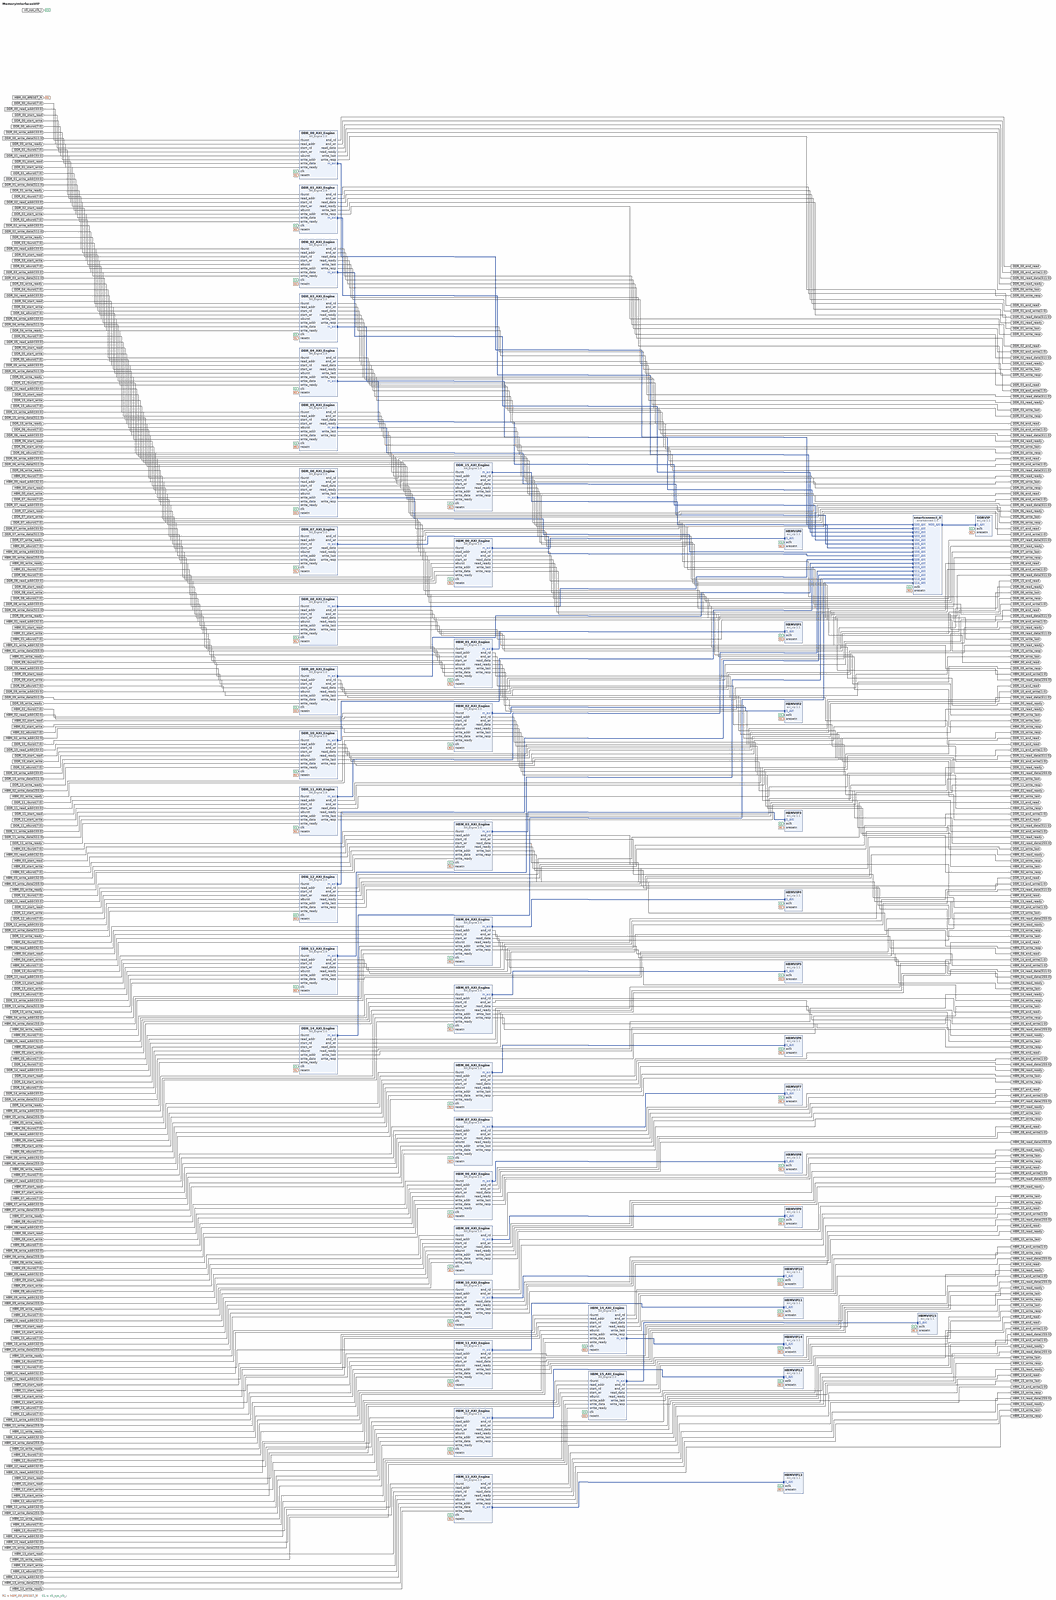
[diagram p0: block diagram of the top level, whole]
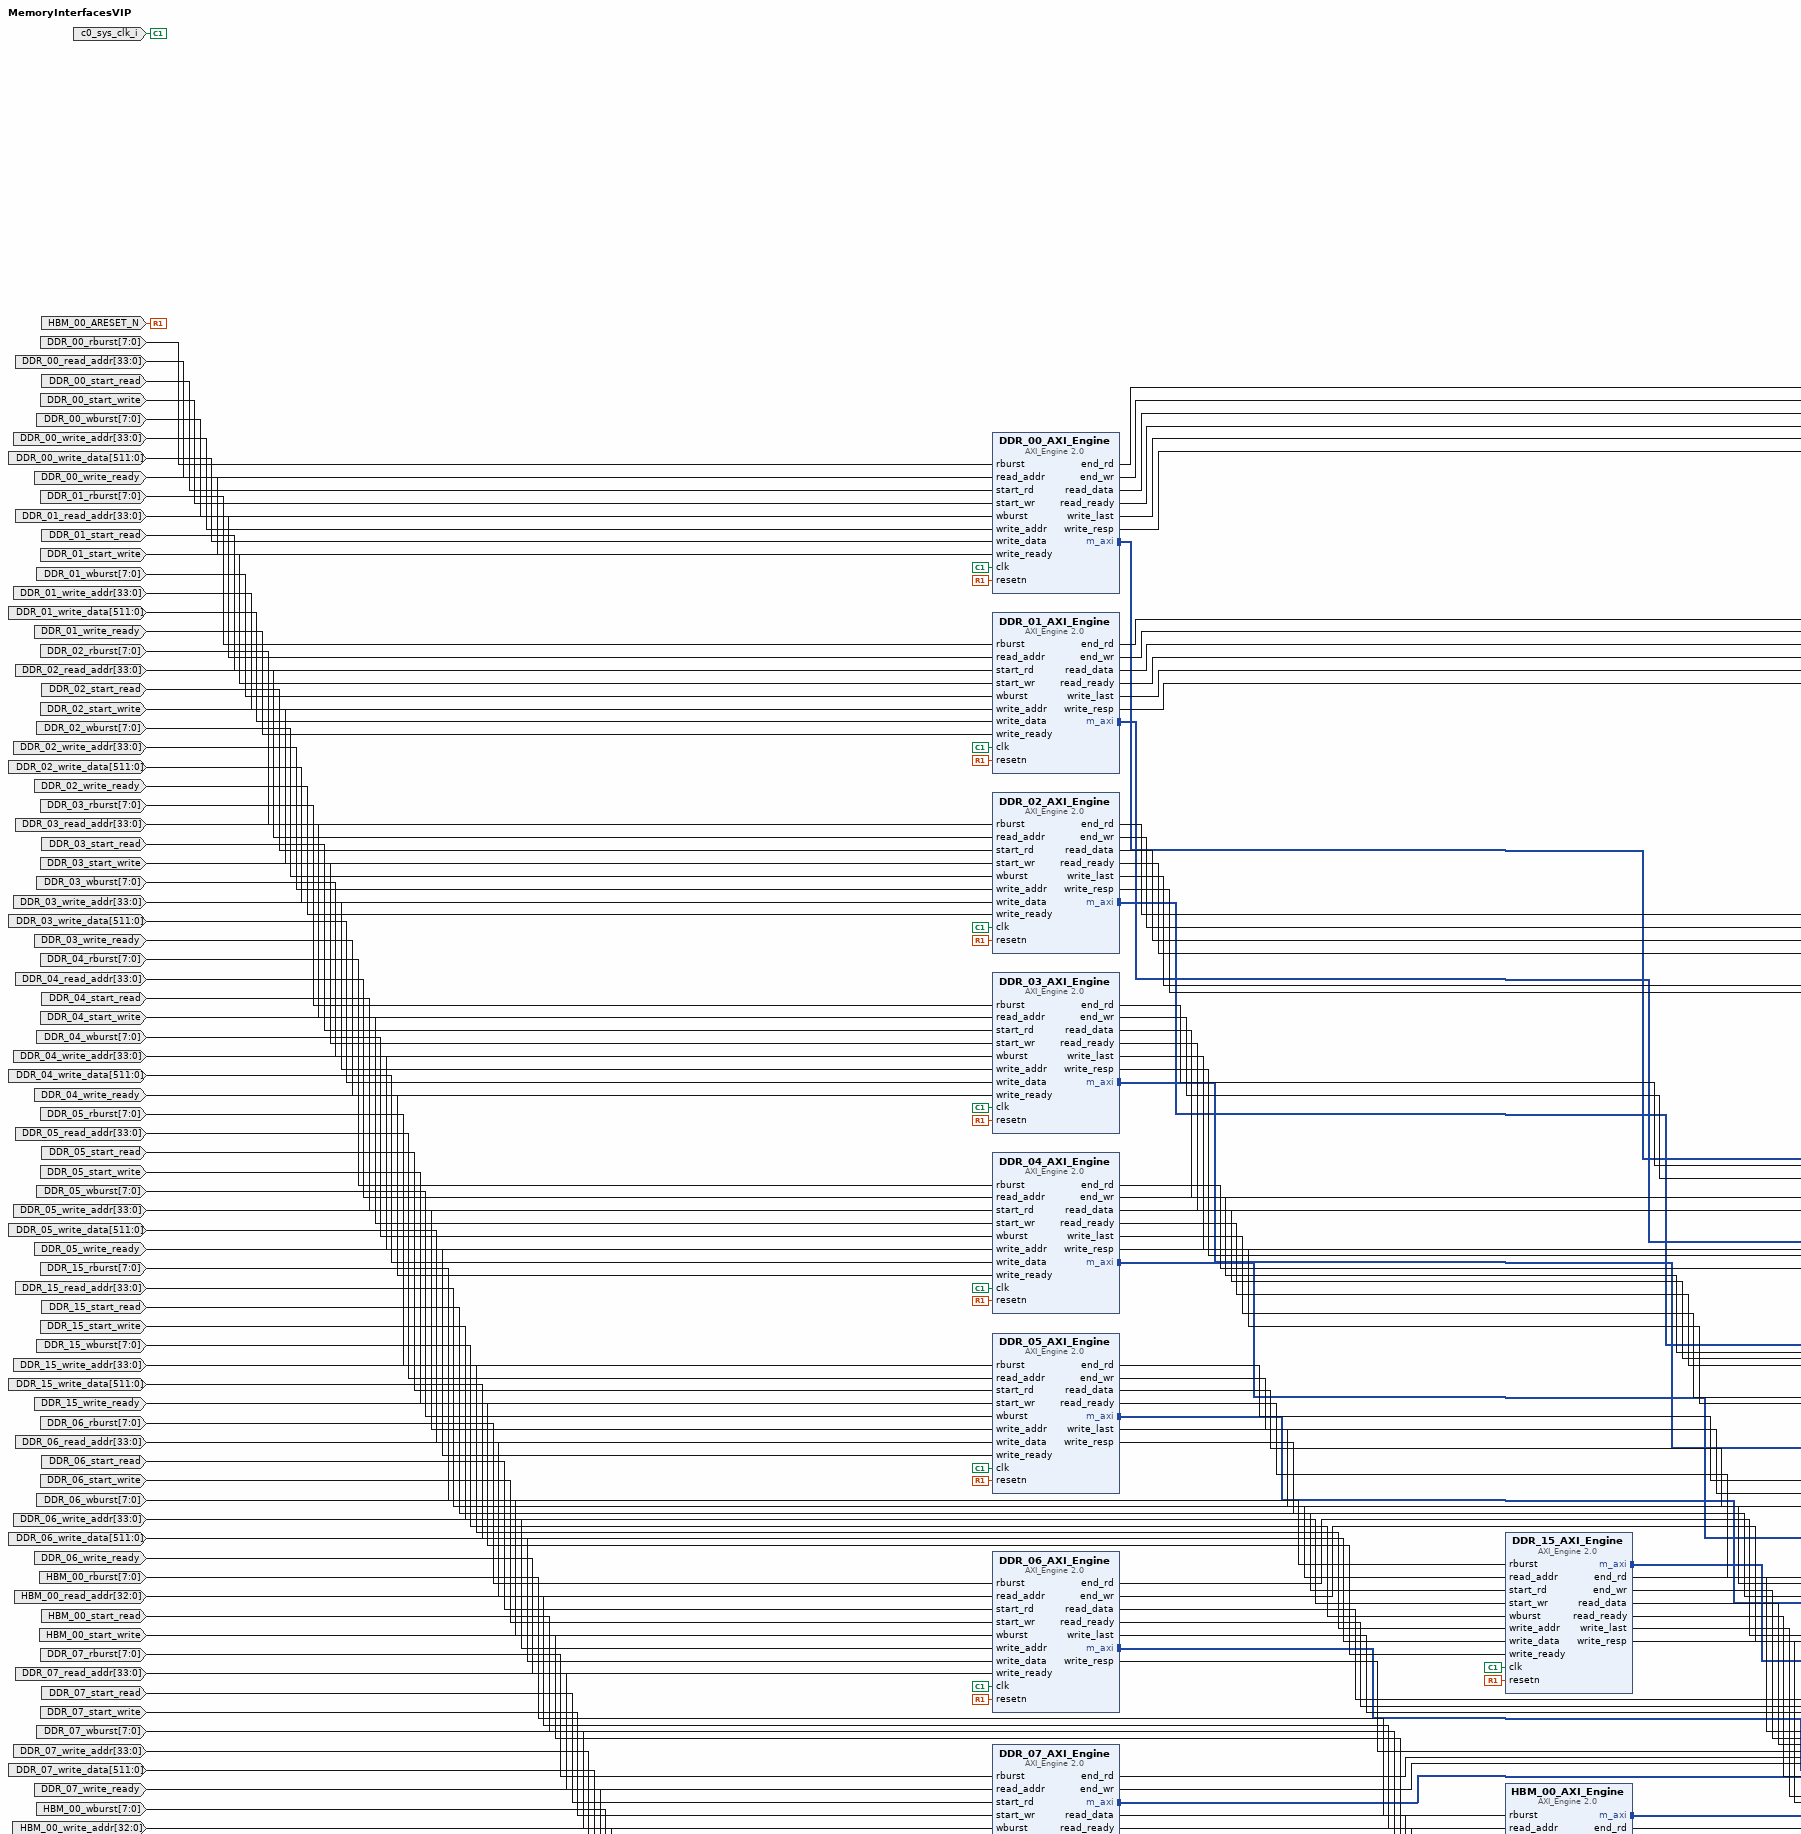
[diagram p1: block diagram of the top level, upper left part]
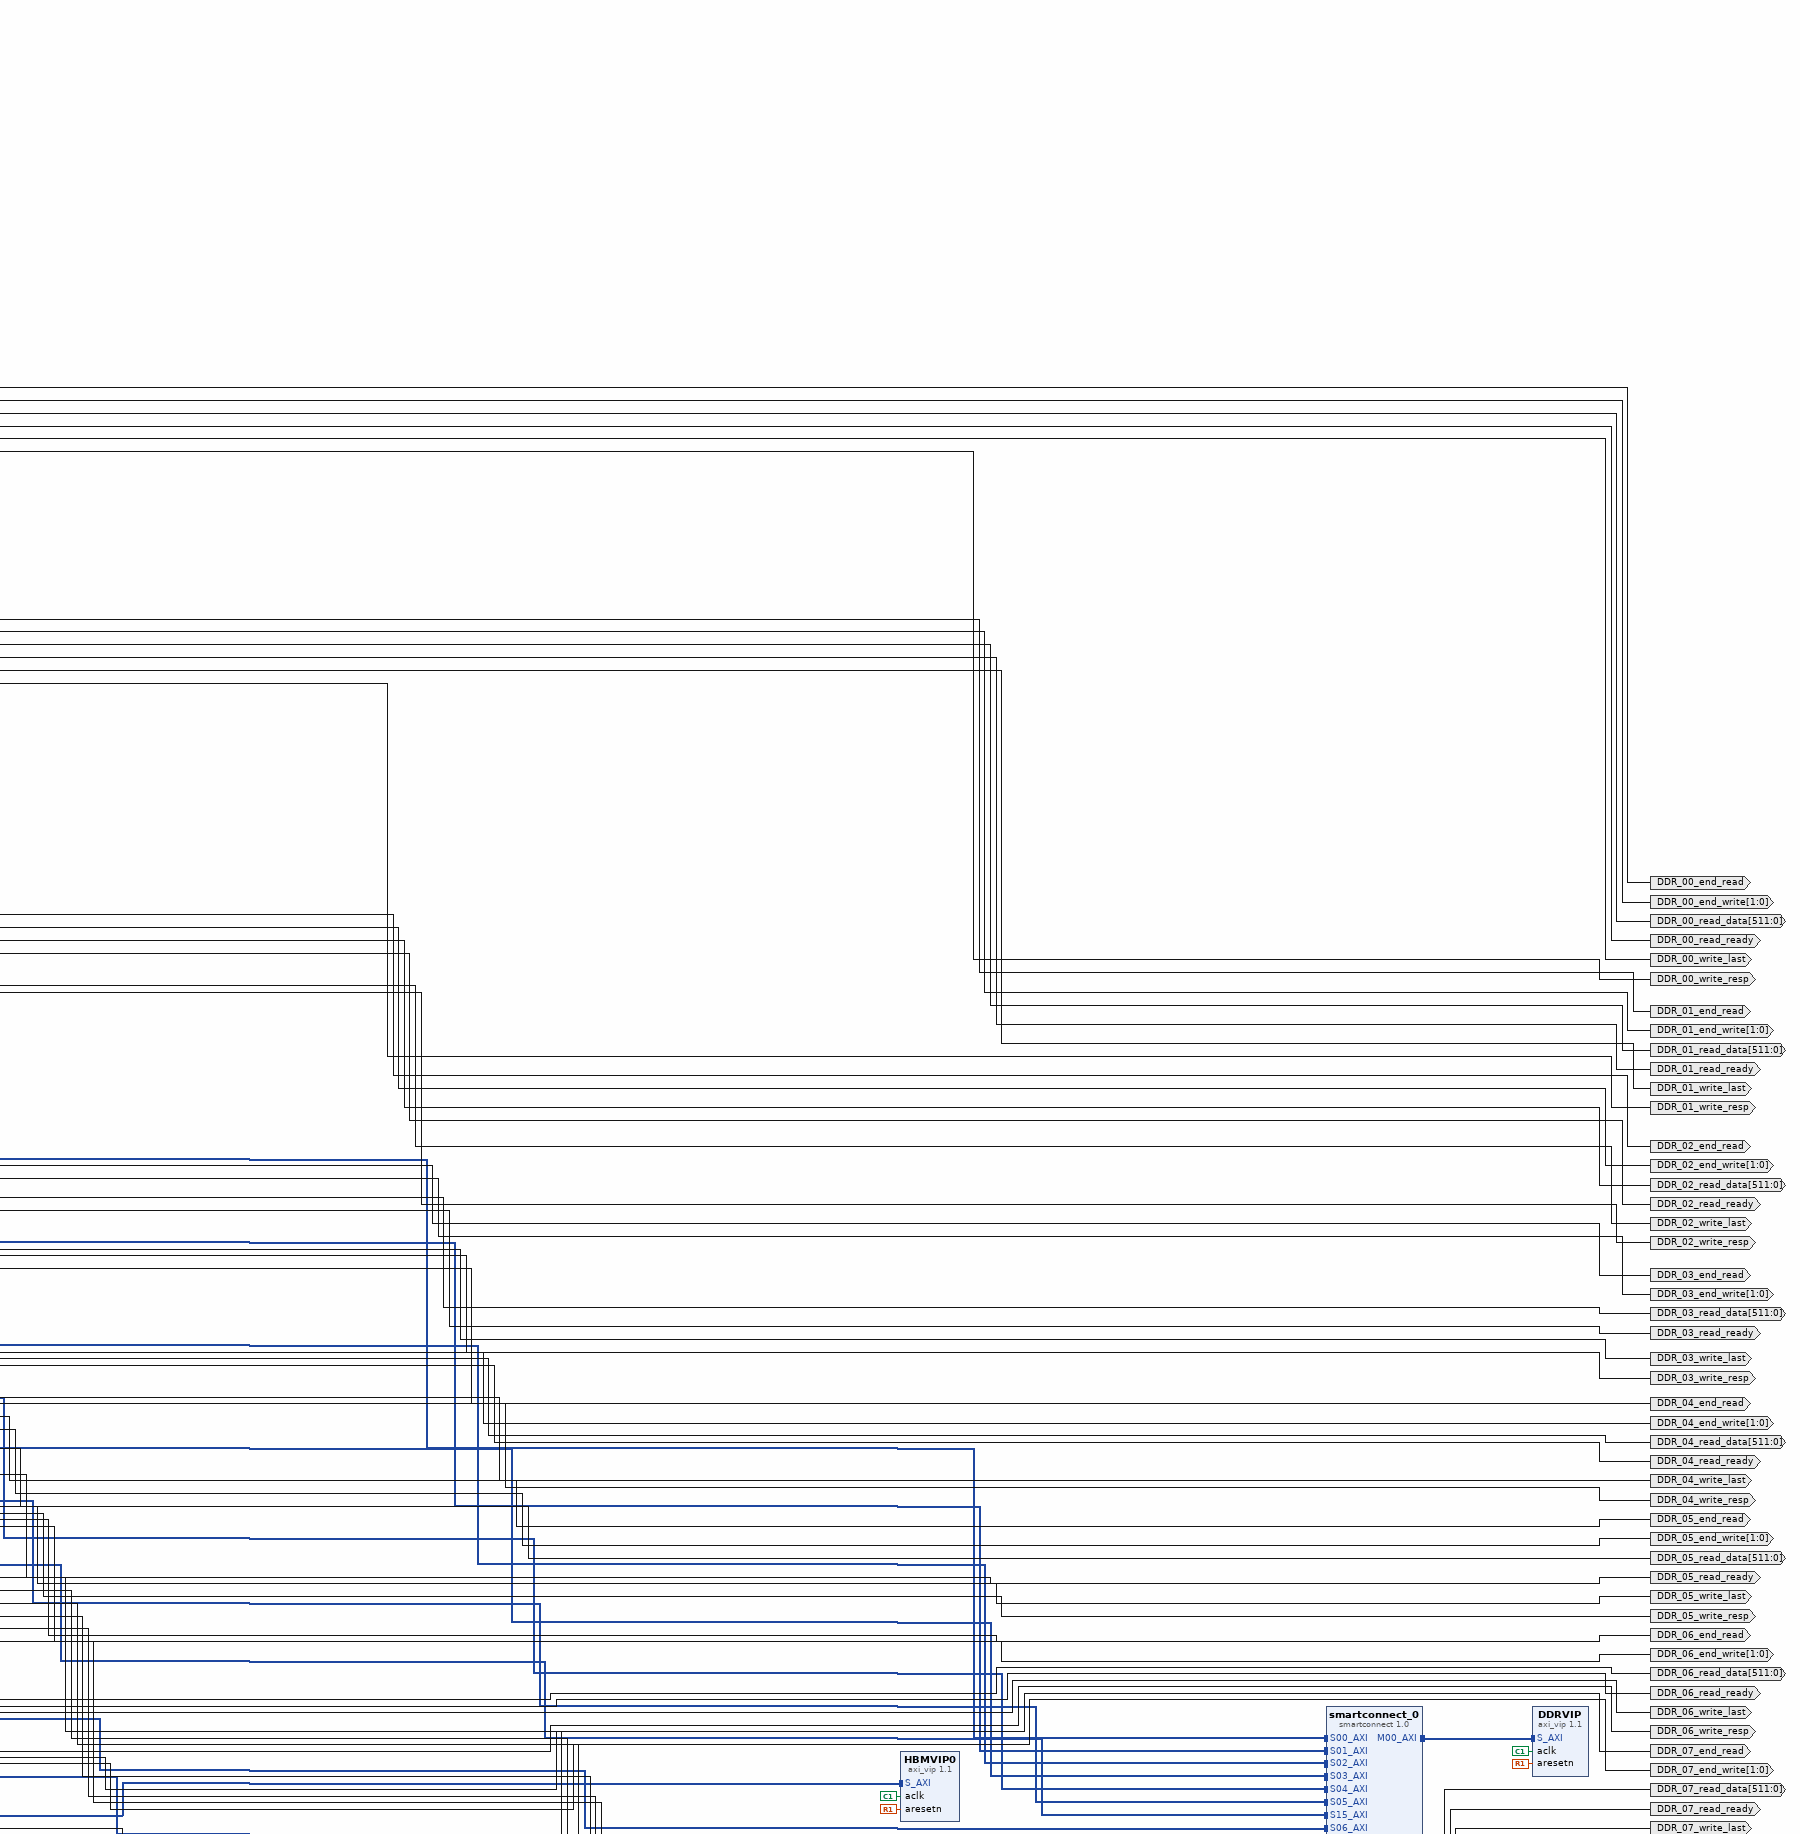
[diagram p2: block diagram of the top level, upper right part]
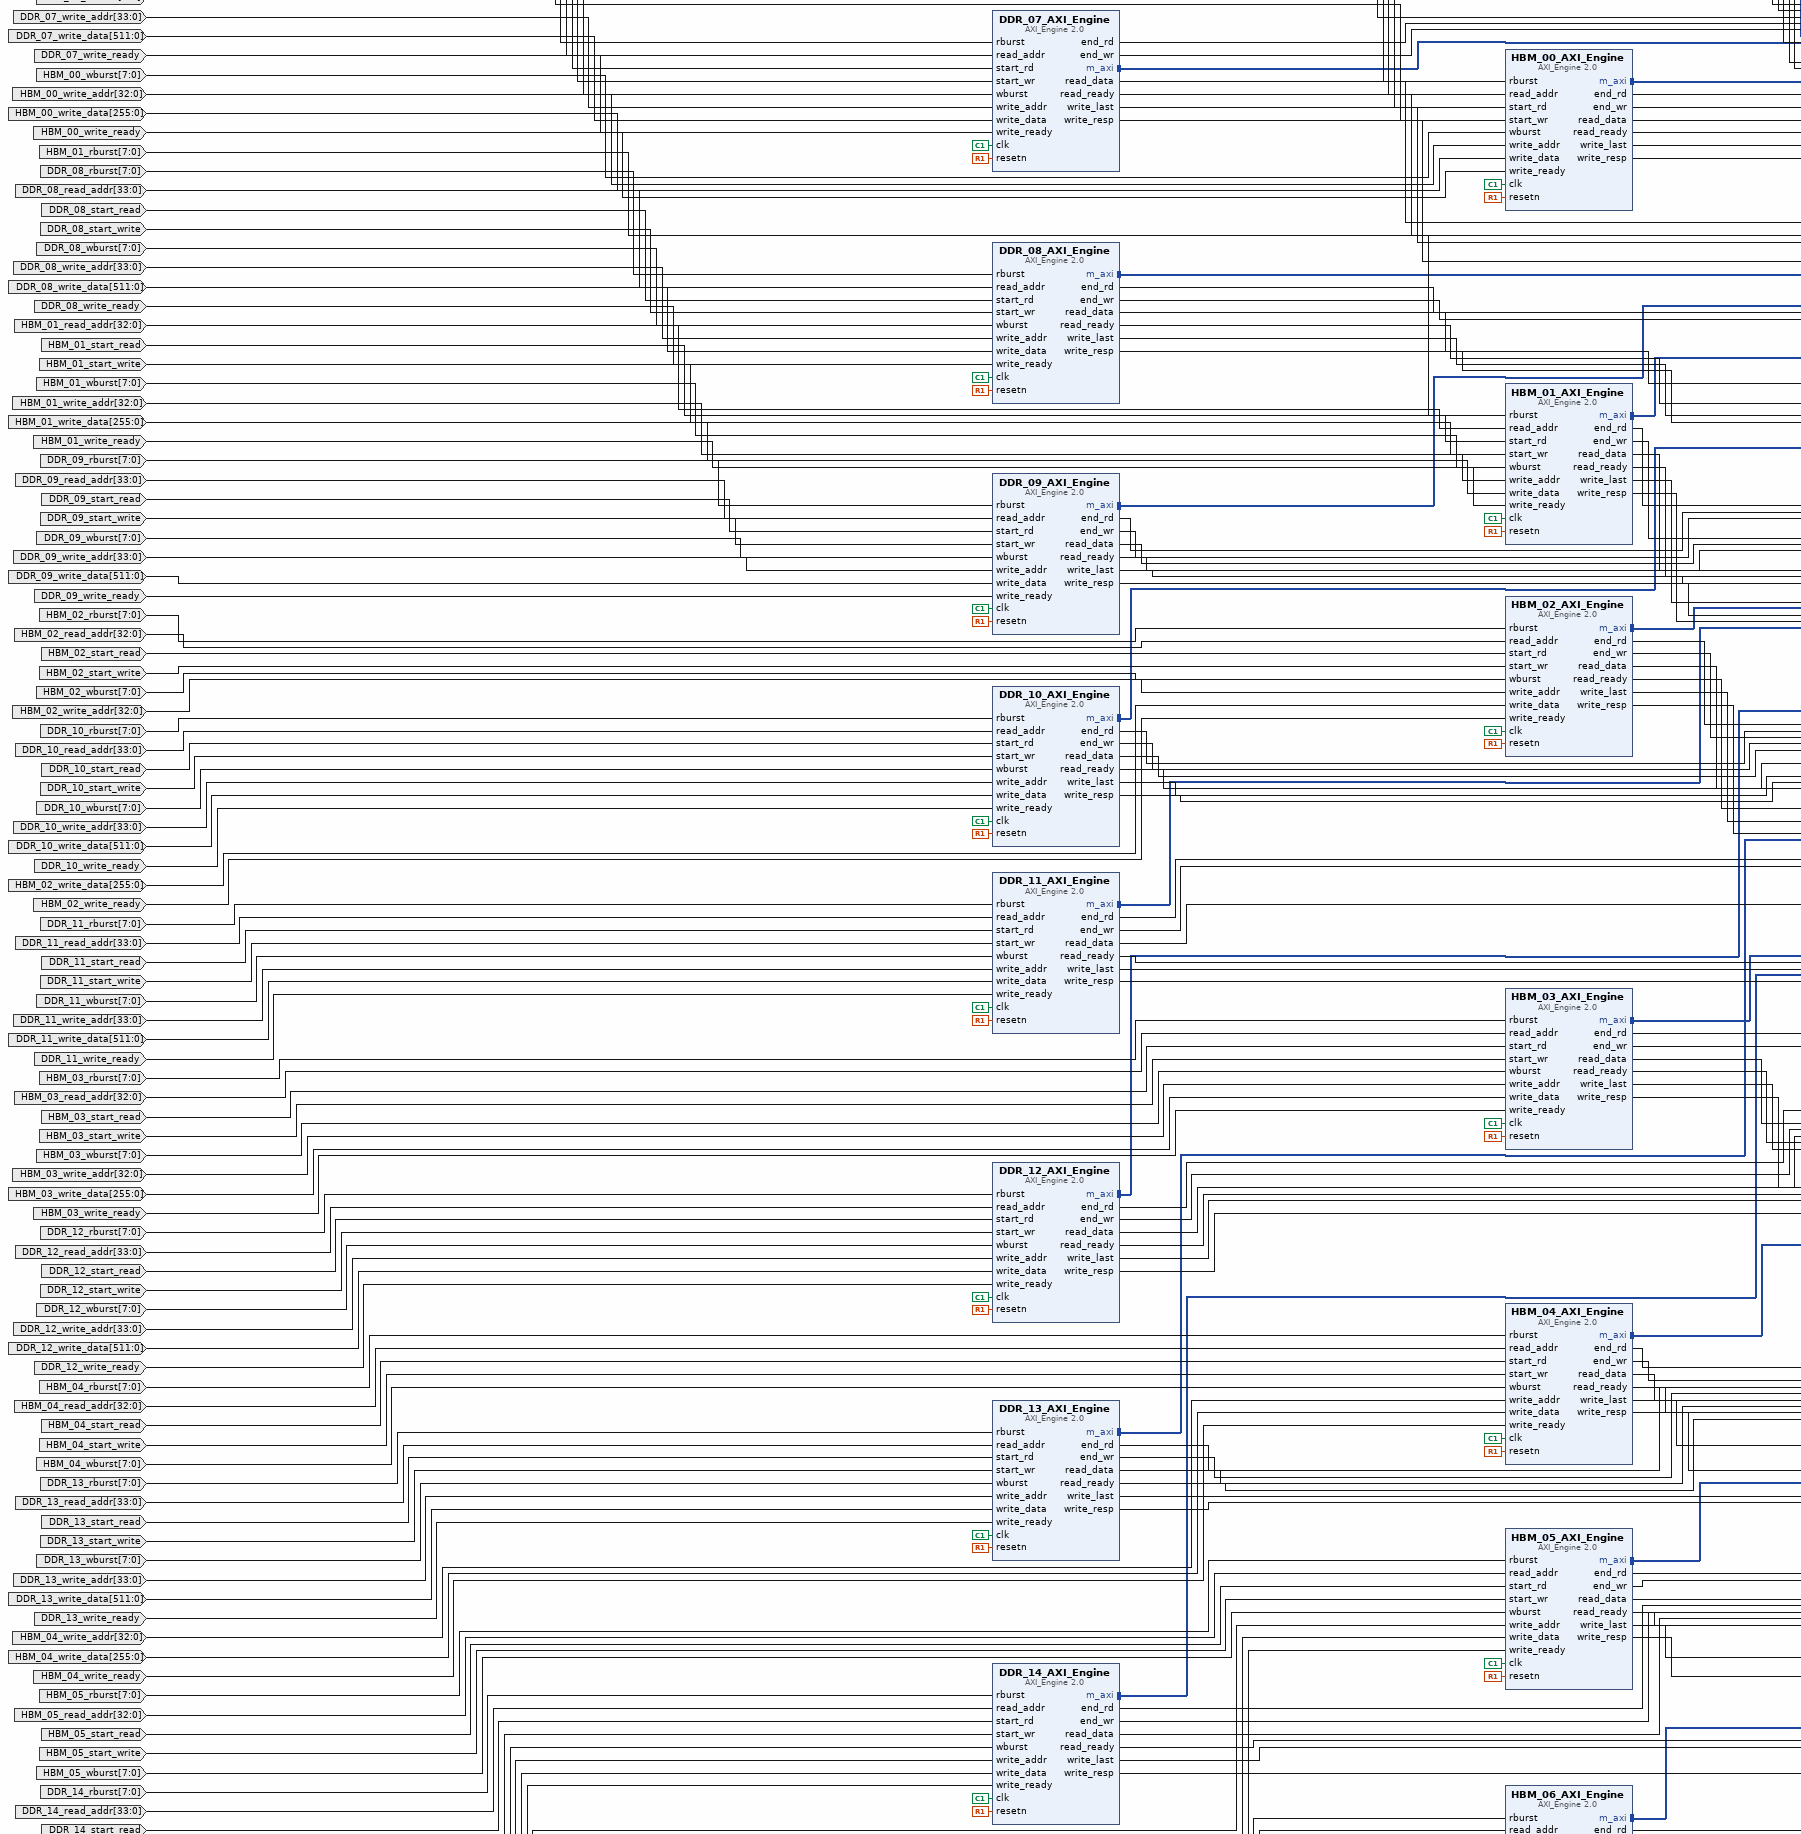
[diagram p3: block diagram of the top level, middle left part]
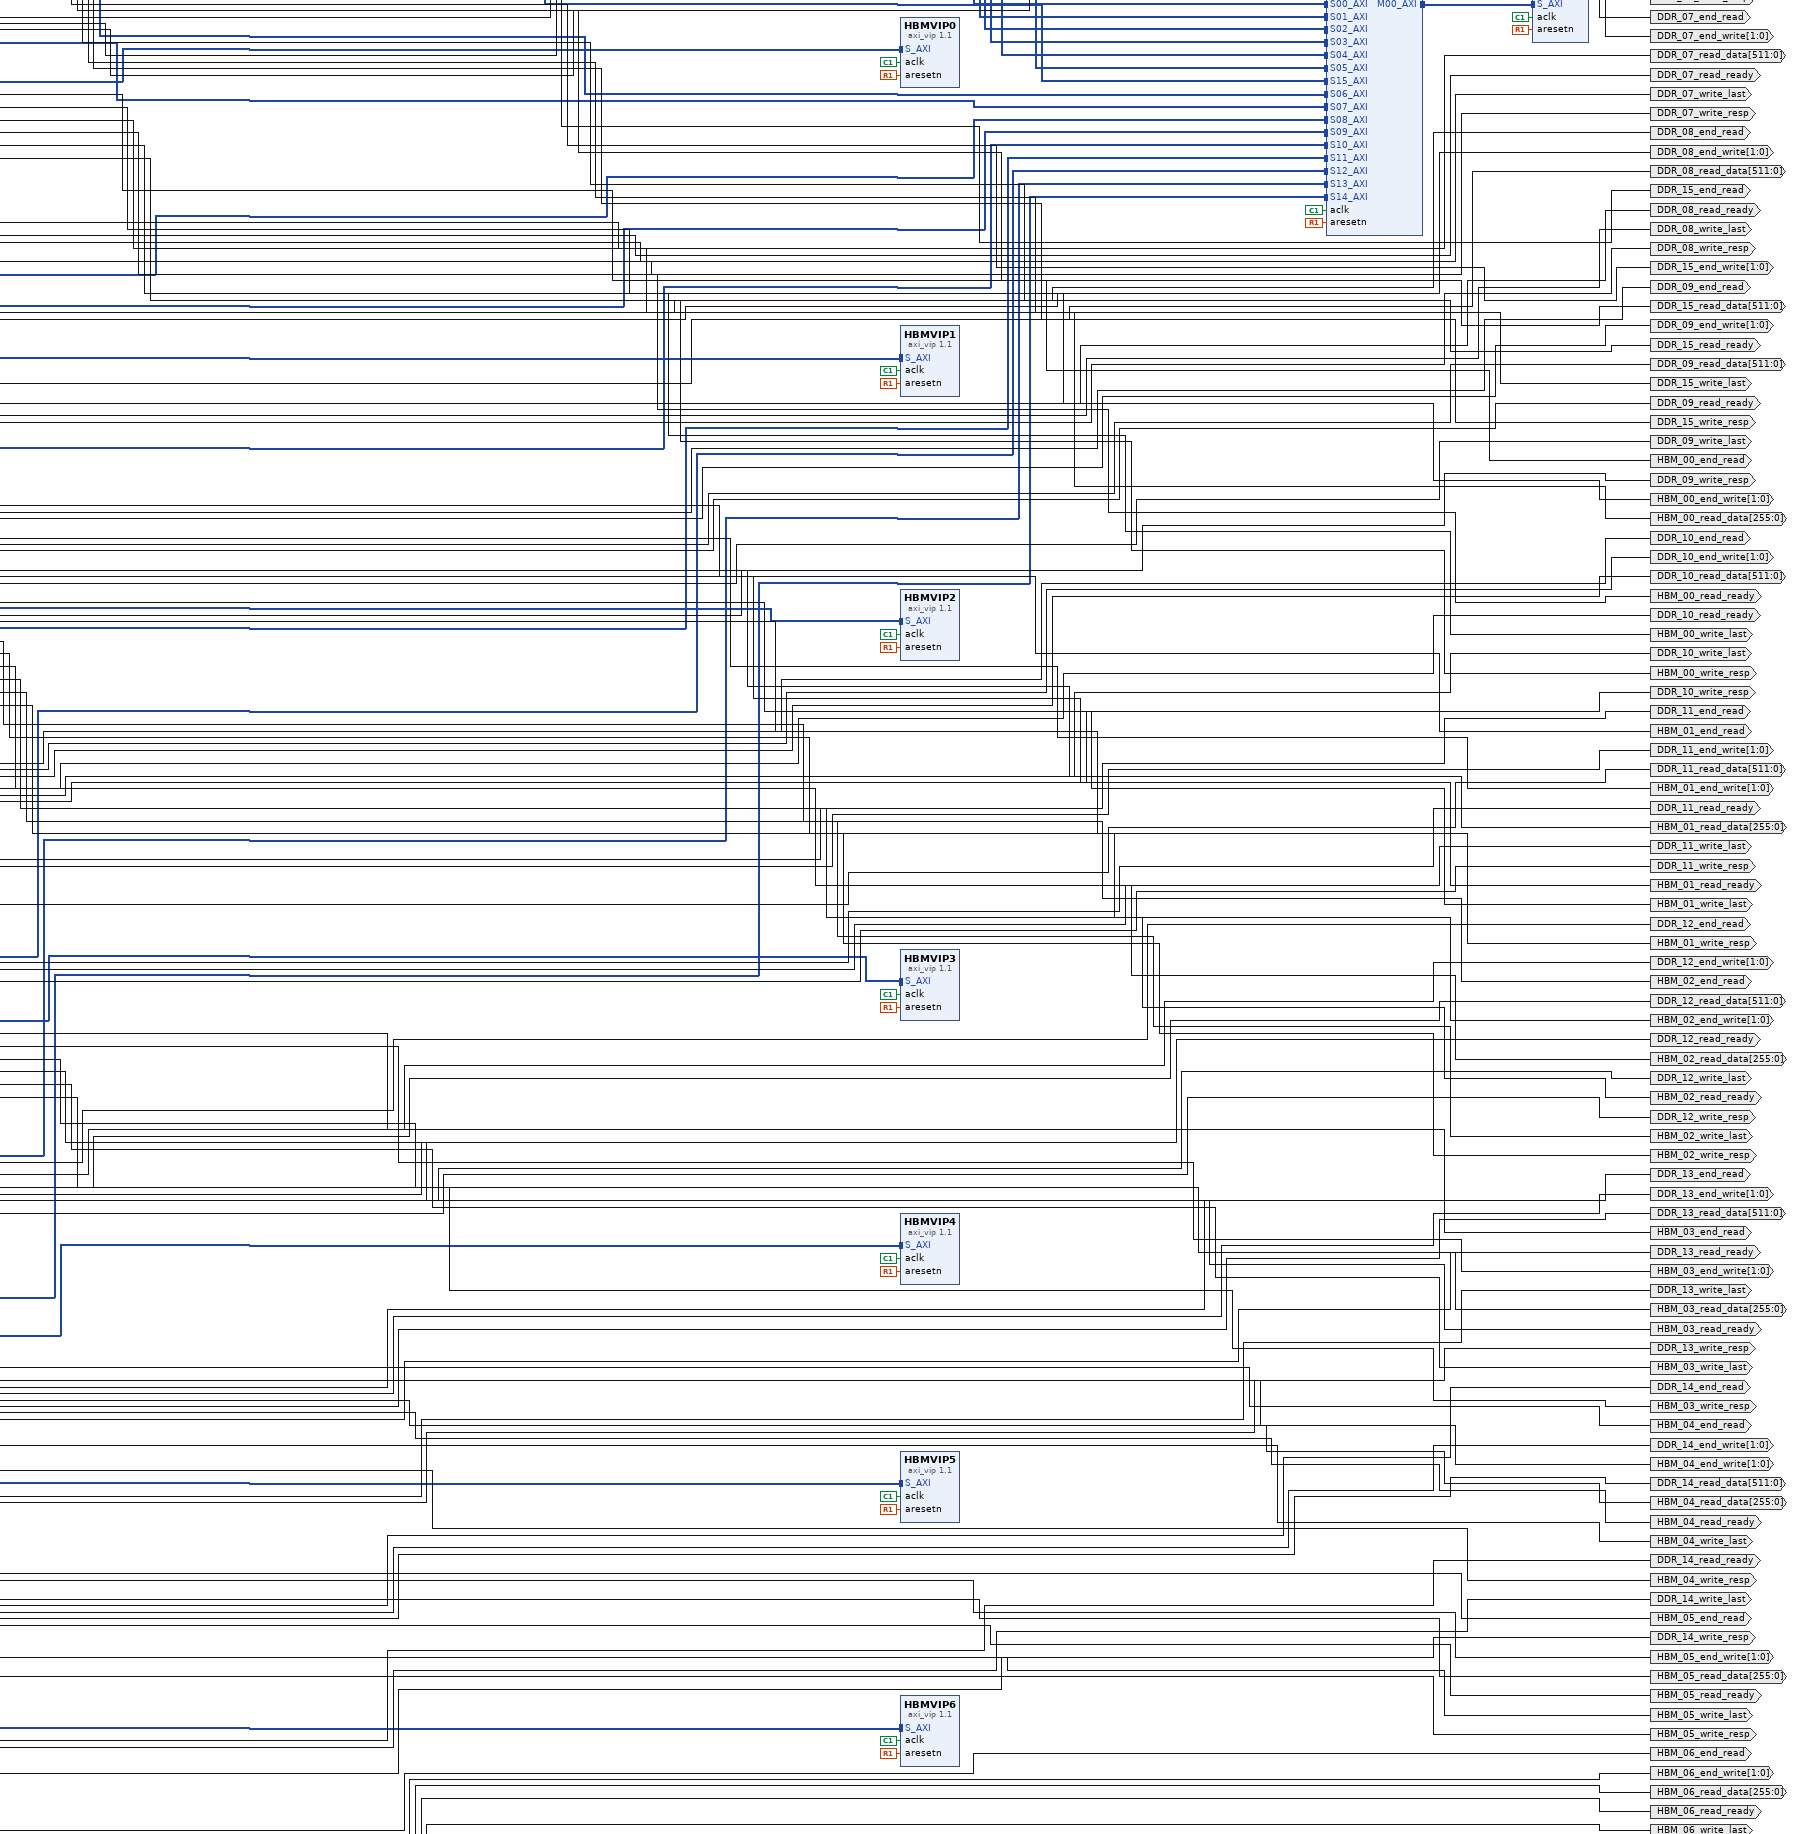
[diagram p4: block diagram of the top level, middle right part]
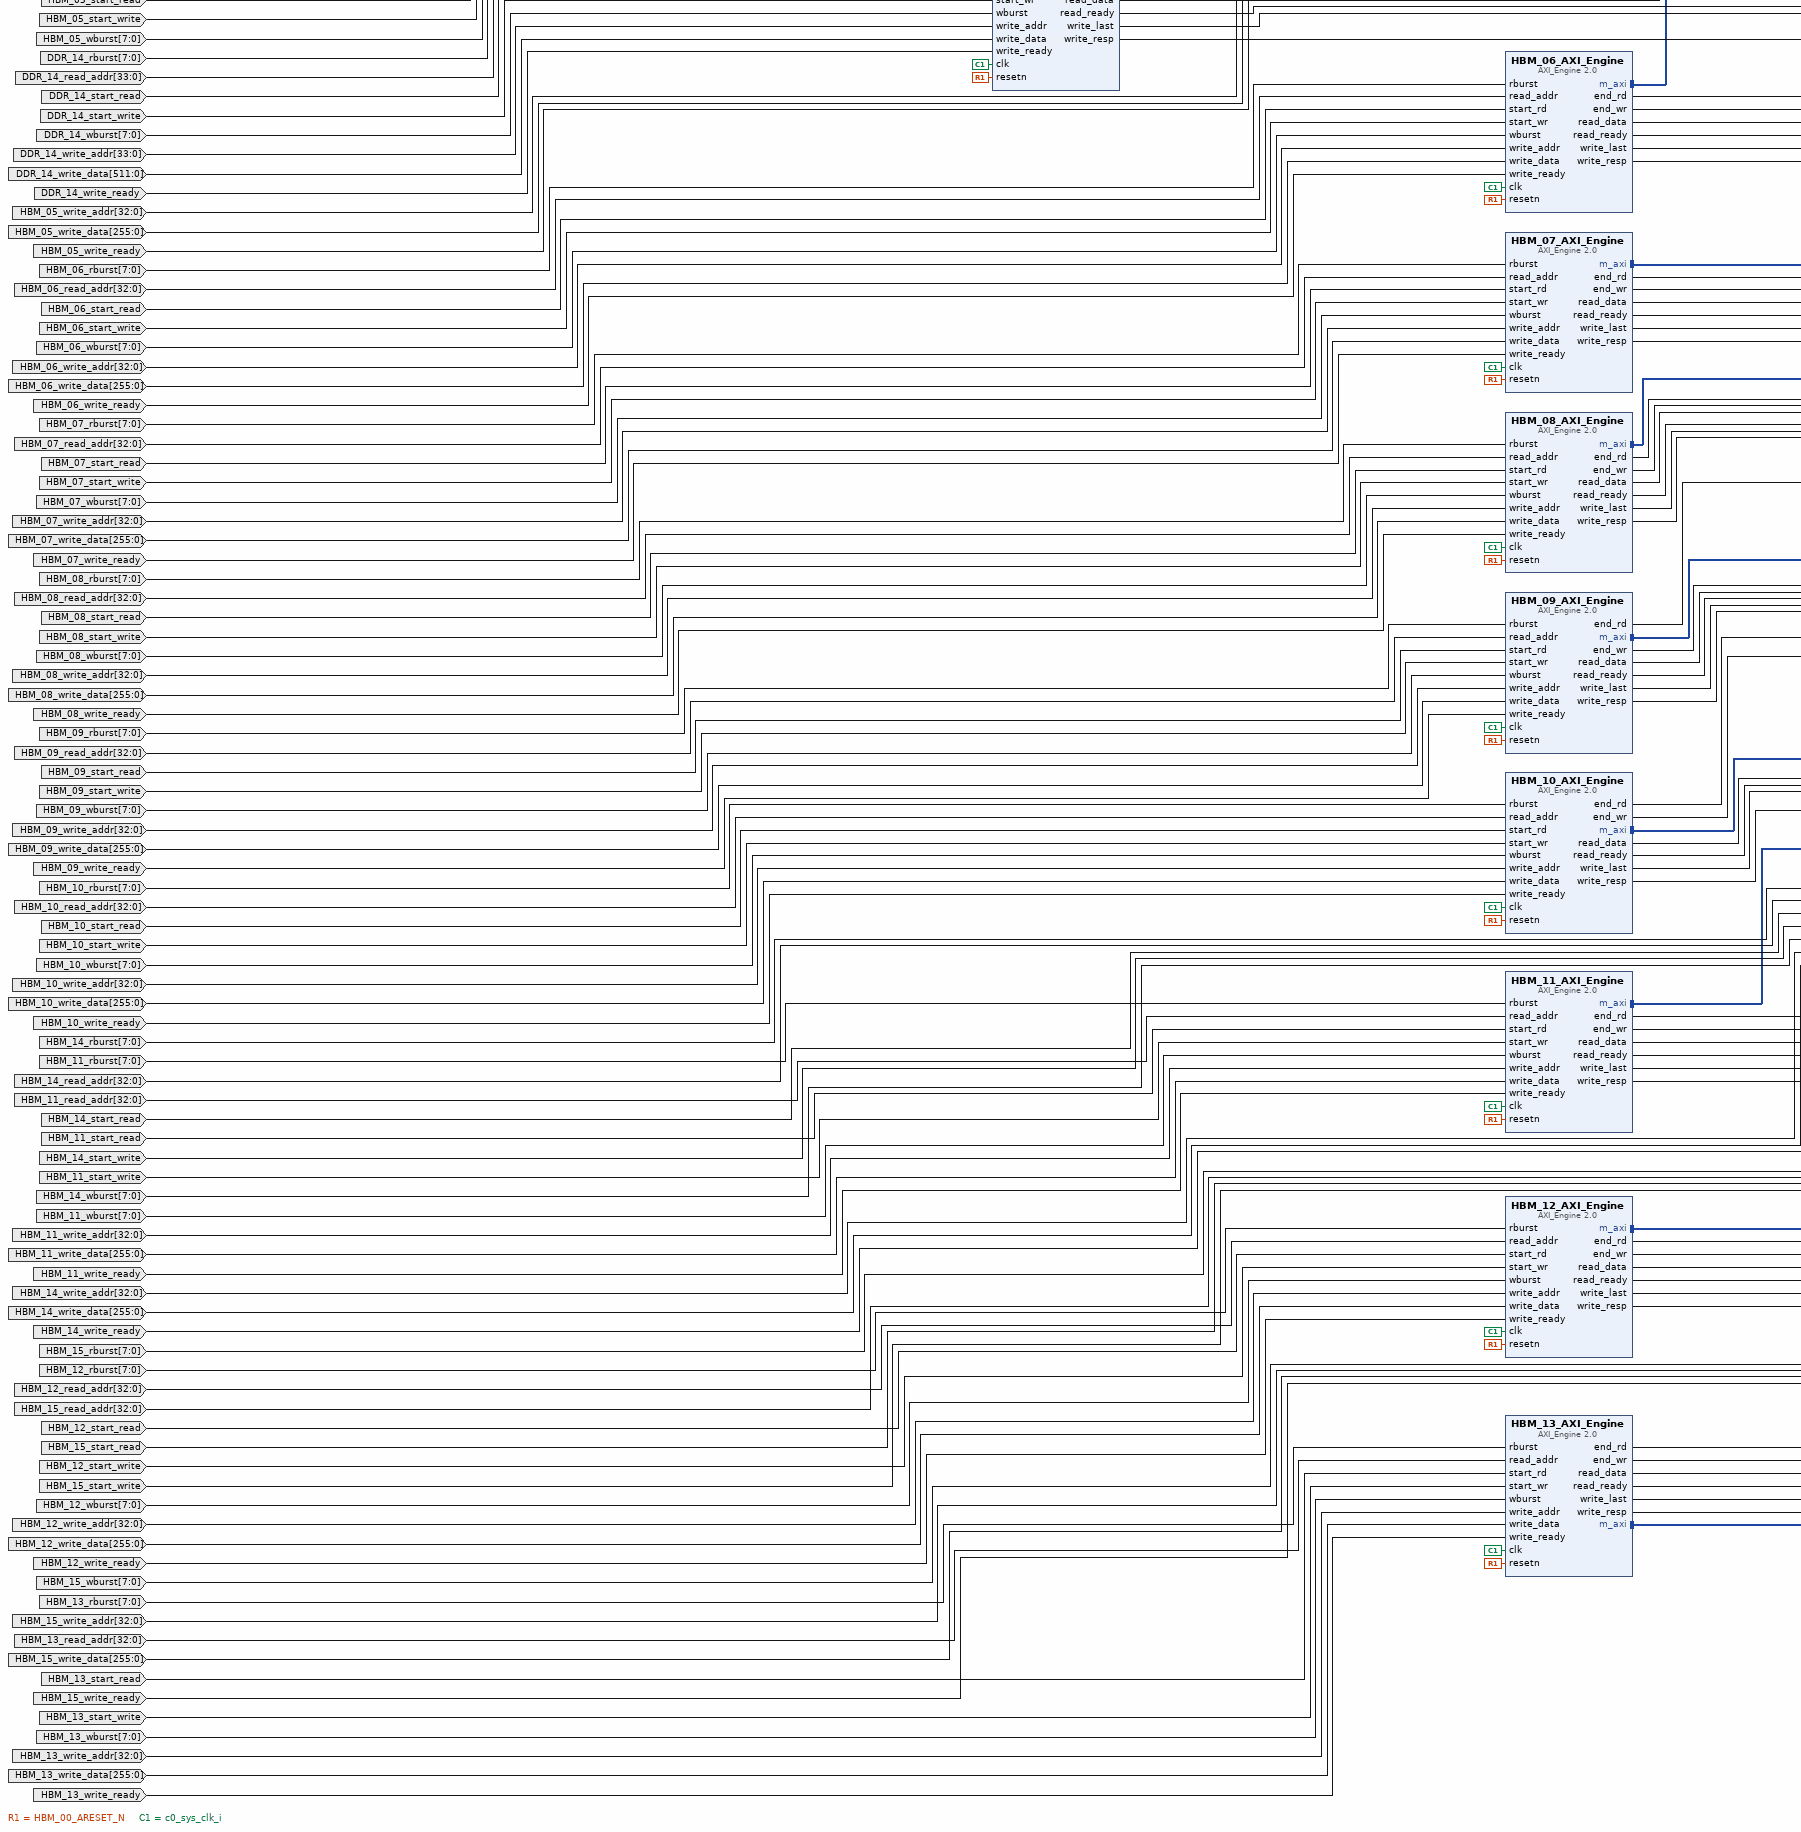
[diagram p5: block diagram of the top level, lower left part]
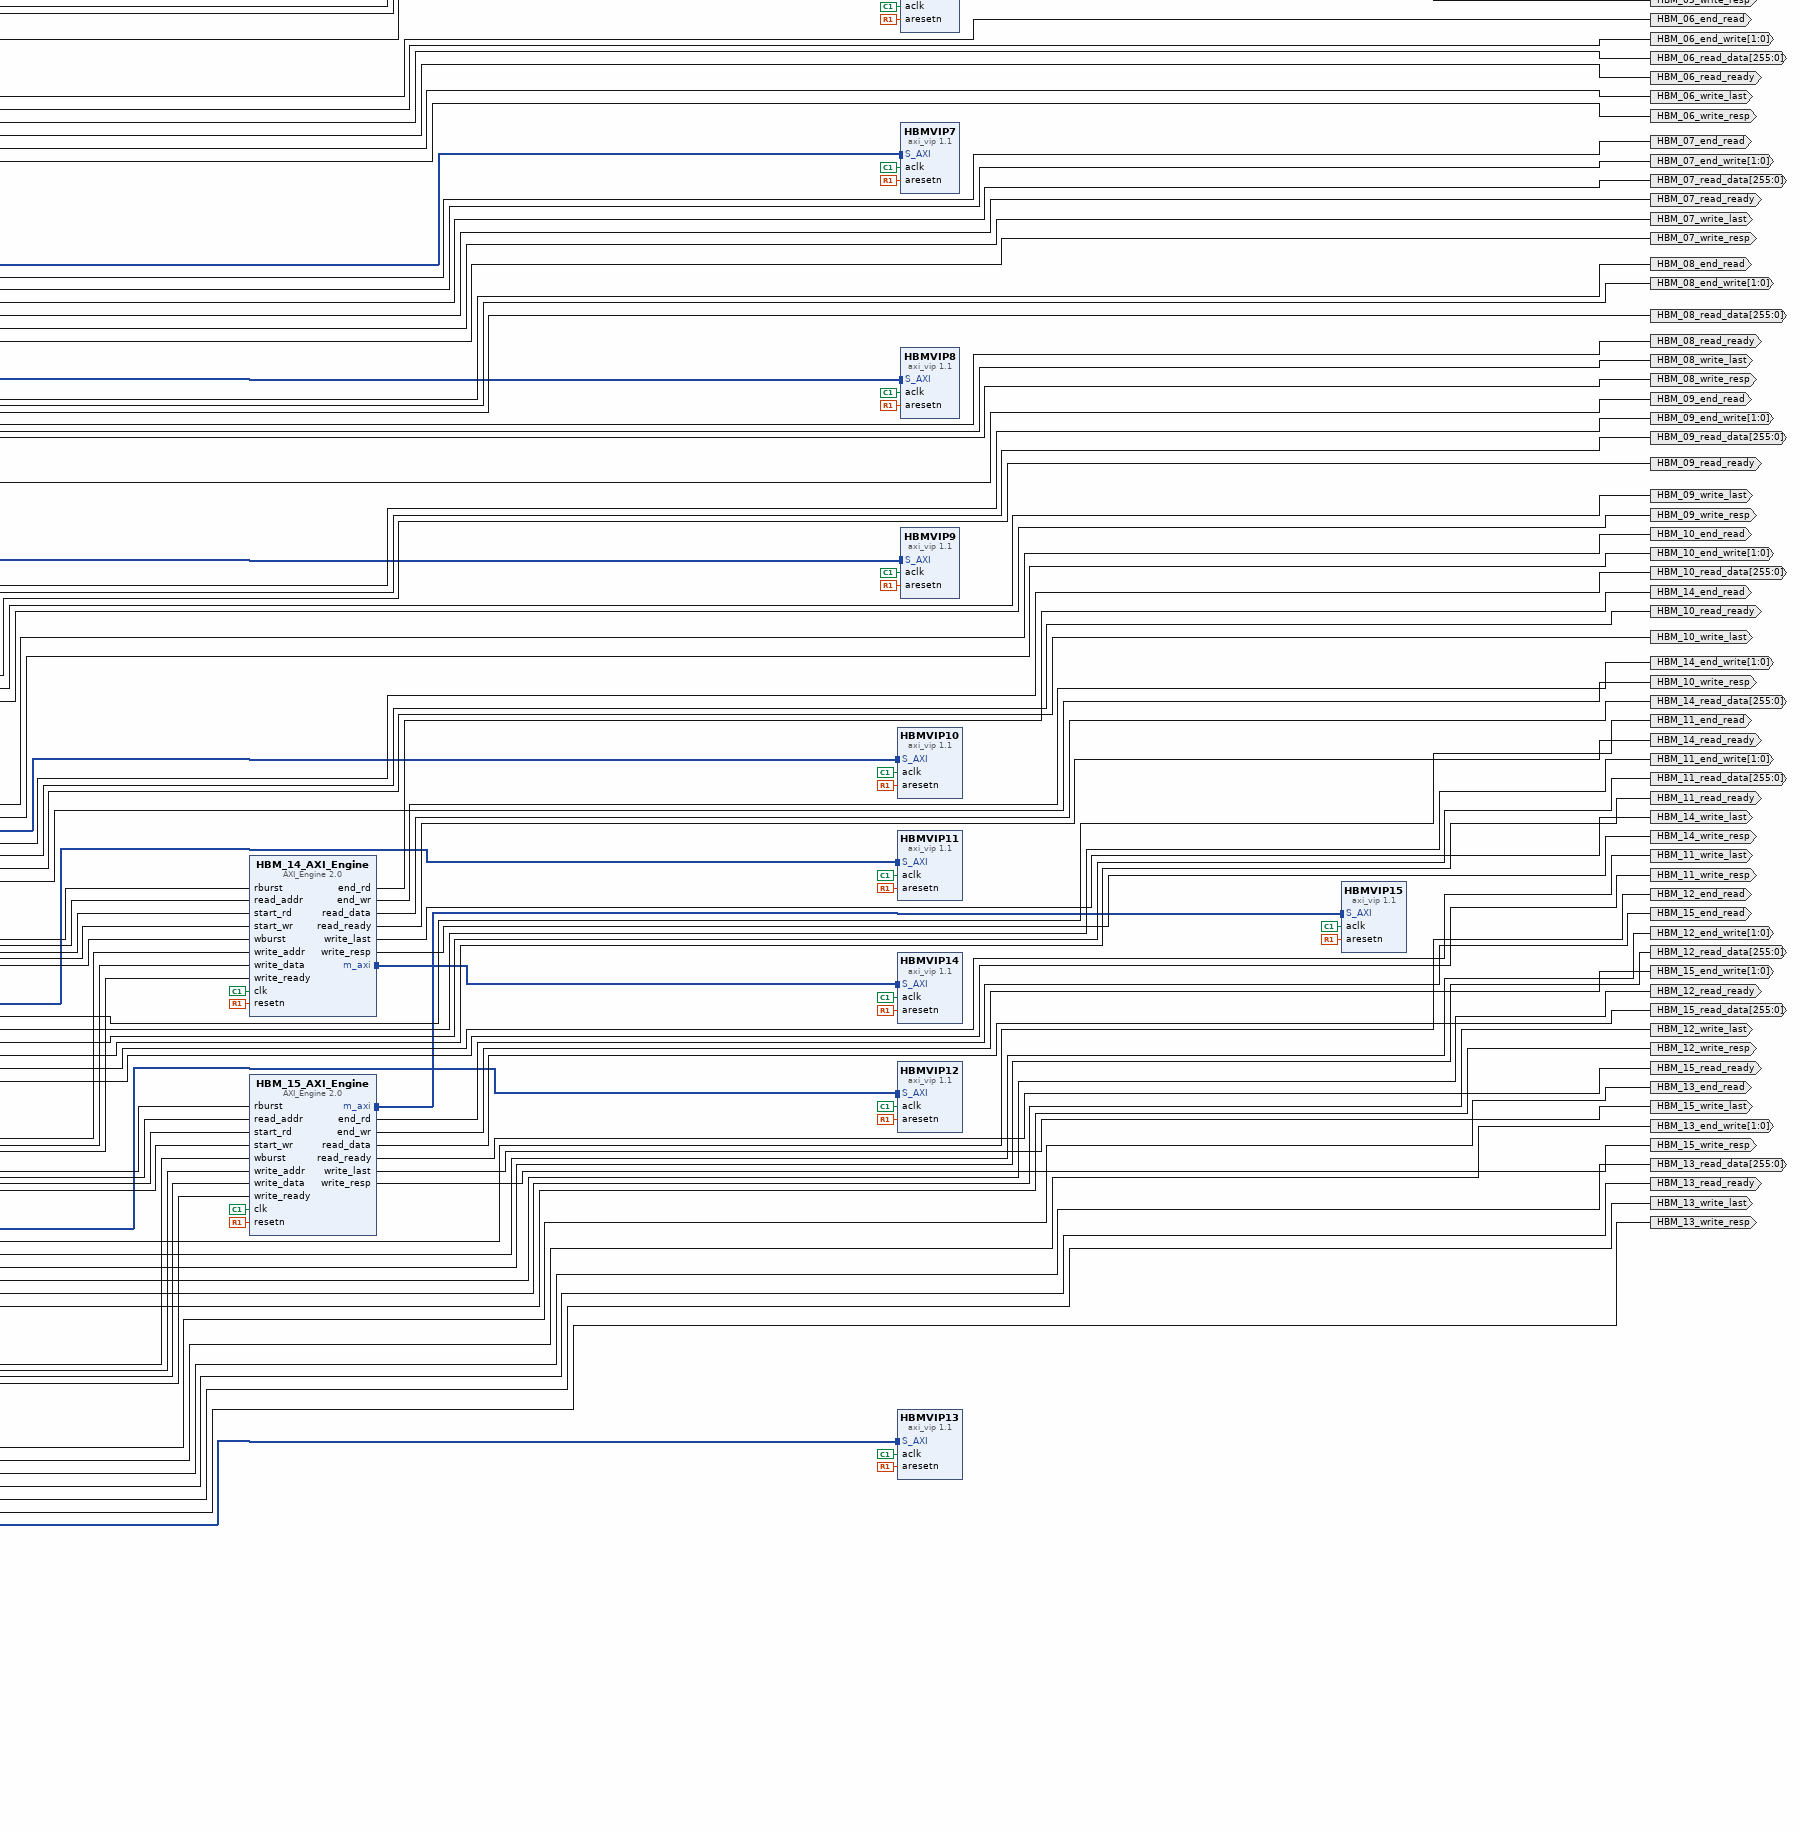
[diagram p6: block diagram of the top level, lower right part]
# Vivado block design MemoryInterfacesVIP, xcu280-fsvh2892-2L-e, Vivado 2022.1
create_bd_design MemoryInterfacesVIP

create_bd_port -dir I -type rst HBM_00_ARESET_N
create_bd_port -dir I -from 7 -to 0 HBM_00_rburst
create_bd_port -dir I -from 32 -to 0 HBM_00_read_addr
create_bd_port -dir I HBM_00_start_read
create_bd_port -dir I HBM_00_start_write
create_bd_port -dir I -from 7 -to 0 HBM_00_wburst
create_bd_port -dir I -from 32 -to 0 HBM_00_write_addr
create_bd_port -dir I -from 255 -to 0 -type data HBM_00_write_data
create_bd_port -dir I HBM_00_write_ready
create_bd_port -dir I -type clk c0_sys_clk_i
set_property -dict {CONFIG.ASSOCIATED_RESET HBM_00_ARESET_N CONFIG.FREQ_HZ 300000000} [get_bd_ports c0_sys_clk_i]
create_bd_port -dir O HBM_00_end_read
create_bd_port -dir O -from 1 -to 0 HBM_00_end_write
create_bd_port -dir O -from 255 -to 0 -type data HBM_00_read_data
create_bd_port -dir O HBM_00_read_ready
create_bd_port -dir O HBM_00_write_resp
create_bd_port -dir O DDR_00_end_read
create_bd_port -dir O -from 1 -to 0 DDR_00_end_write
create_bd_port -dir I -from 7 -to 0 DDR_00_rburst
create_bd_port -dir I -from 33 -to 0 DDR_00_read_addr
create_bd_port -dir O -from 511 -to 0 -type data DDR_00_read_data
create_bd_port -dir O DDR_00_read_ready
create_bd_port -dir I DDR_00_start_read
create_bd_port -dir I DDR_00_start_write
create_bd_port -dir I -from 7 -to 0 DDR_00_wburst
create_bd_port -dir I -from 33 -to 0 DDR_00_write_addr
create_bd_port -dir O DDR_00_write_resp
create_bd_port -dir I -from 511 -to 0 -type data DDR_00_write_data
create_bd_port -dir I DDR_00_write_ready
create_bd_port -dir O DDR_00_write_last
create_bd_port -dir O HBM_00_write_last
create_bd_port -dir I DDR_01_start_write
create_bd_port -dir I DDR_02_start_write
create_bd_port -dir I DDR_03_start_write
create_bd_port -dir I DDR_04_start_write
create_bd_port -dir I DDR_05_start_write
create_bd_port -dir I DDR_06_start_write
create_bd_port -dir I DDR_07_start_write
create_bd_port -dir I DDR_08_start_write
create_bd_port -dir I DDR_09_start_write
create_bd_port -dir I DDR_10_start_write
create_bd_port -dir I DDR_11_start_write
create_bd_port -dir I DDR_12_start_write
create_bd_port -dir I DDR_13_start_write
create_bd_port -dir I DDR_14_start_write
create_bd_port -dir I DDR_15_start_write
create_bd_port -dir I DDR_01_start_read
create_bd_port -dir I DDR_02_start_read
create_bd_port -dir I DDR_03_start_read
create_bd_port -dir I DDR_04_start_read
create_bd_port -dir I DDR_05_start_read
create_bd_port -dir I DDR_06_start_read
create_bd_port -dir I DDR_07_start_read
create_bd_port -dir I DDR_08_start_read
create_bd_port -dir I DDR_09_start_read
create_bd_port -dir I DDR_10_start_read
create_bd_port -dir I DDR_11_start_read
create_bd_port -dir I DDR_12_start_read
create_bd_port -dir I DDR_13_start_read
create_bd_port -dir I DDR_14_start_read
create_bd_port -dir I DDR_15_start_read
create_bd_port -dir I -from 33 -to 0 DDR_01_write_addr
create_bd_port -dir I -from 33 -to 0 DDR_02_write_addr
create_bd_port -dir I -from 33 -to 0 DDR_03_write_addr
create_bd_port -dir I -from 33 -to 0 DDR_04_write_addr
create_bd_port -dir I -from 33 -to 0 DDR_05_write_addr
create_bd_port -dir I -from 33 -to 0 DDR_06_write_addr
create_bd_port -dir I -from 33 -to 0 DDR_07_write_addr
create_bd_port -dir I -from 33 -to 0 DDR_08_write_addr
create_bd_port -dir I -from 33 -to 0 DDR_09_write_addr
create_bd_port -dir I -from 33 -to 0 DDR_10_write_addr
create_bd_port -dir I -from 33 -to 0 DDR_11_write_addr
create_bd_port -dir I -from 33 -to 0 DDR_12_write_addr
create_bd_port -dir I -from 33 -to 0 DDR_13_write_addr
create_bd_port -dir I -from 33 -to 0 DDR_14_write_addr
create_bd_port -dir I -from 33 -to 0 DDR_15_write_addr
create_bd_port -dir I -from 33 -to 0 DDR_01_read_addr
create_bd_port -dir I -from 33 -to 0 DDR_02_read_addr
create_bd_port -dir I -from 33 -to 0 DDR_03_read_addr
create_bd_port -dir I -from 33 -to 0 DDR_04_read_addr
create_bd_port -dir I -from 33 -to 0 DDR_05_read_addr
create_bd_port -dir I -from 33 -to 0 DDR_06_read_addr
create_bd_port -dir I -from 33 -to 0 DDR_07_read_addr
create_bd_port -dir I -from 33 -to 0 DDR_08_read_addr
create_bd_port -dir I -from 33 -to 0 DDR_09_read_addr
create_bd_port -dir I -from 33 -to 0 DDR_10_read_addr
create_bd_port -dir I -from 33 -to 0 DDR_11_read_addr
create_bd_port -dir I -from 33 -to 0 DDR_12_read_addr
create_bd_port -dir I -from 33 -to 0 DDR_13_read_addr
create_bd_port -dir I -from 33 -to 0 DDR_14_read_addr
create_bd_port -dir I -from 33 -to 0 DDR_15_read_addr
create_bd_port -dir I -from 511 -to 0 -type data DDR_01_write_data
create_bd_port -dir I -from 511 -to 0 -type data DDR_02_write_data
create_bd_port -dir I -from 511 -to 0 -type data DDR_03_write_data
create_bd_port -dir I -from 511 -to 0 -type data DDR_04_write_data
create_bd_port -dir I -from 511 -to 0 -type data DDR_05_write_data
create_bd_port -dir I -from 511 -to 0 -type data DDR_06_write_data
create_bd_port -dir I -from 511 -to 0 -type data DDR_07_write_data
create_bd_port -dir I -from 511 -to 0 -type data DDR_08_write_data
create_bd_port -dir I -from 511 -to 0 -type data DDR_09_write_data
create_bd_port -dir I -from 511 -to 0 -type data DDR_10_write_data
create_bd_port -dir I -from 511 -to 0 -type data DDR_11_write_data
create_bd_port -dir I -from 511 -to 0 -type data DDR_12_write_data
create_bd_port -dir I -from 511 -to 0 -type data DDR_13_write_data
create_bd_port -dir I -from 511 -to 0 -type data DDR_14_write_data
create_bd_port -dir I -from 511 -to 0 -type data DDR_15_write_data
create_bd_port -dir O -from 511 -to 0 -type data DDR_01_read_data
create_bd_port -dir O -from 511 -to 0 -type data DDR_02_read_data
create_bd_port -dir O -from 511 -to 0 -type data DDR_03_read_data
create_bd_port -dir O -from 511 -to 0 -type data DDR_04_read_data
create_bd_port -dir O -from 511 -to 0 -type data DDR_05_read_data
create_bd_port -dir O -from 511 -to 0 -type data DDR_06_read_data
create_bd_port -dir O -from 511 -to 0 -type data DDR_07_read_data
create_bd_port -dir O -from 511 -to 0 -type data DDR_08_read_data
create_bd_port -dir O -from 511 -to 0 -type data DDR_09_read_data
create_bd_port -dir O -from 511 -to 0 -type data DDR_10_read_data
create_bd_port -dir O -from 511 -to 0 -type data DDR_11_read_data
create_bd_port -dir O -from 511 -to 0 -type data DDR_12_read_data
create_bd_port -dir O -from 511 -to 0 -type data DDR_13_read_data
create_bd_port -dir O -from 511 -to 0 -type data DDR_14_read_data
create_bd_port -dir O -from 511 -to 0 -type data DDR_15_read_data
create_bd_port -dir O -from 1 -to 0 DDR_01_end_write
create_bd_port -dir O -from 1 -to 0 DDR_02_end_write
create_bd_port -dir O -from 1 -to 0 DDR_03_end_write
create_bd_port -dir O -from 1 -to 0 DDR_04_end_write
create_bd_port -dir O -from 1 -to 0 DDR_05_end_write
create_bd_port -dir O -from 1 -to 0 DDR_06_end_write
create_bd_port -dir O -from 1 -to 0 DDR_07_end_write
create_bd_port -dir O -from 1 -to 0 DDR_08_end_write
create_bd_port -dir O -from 1 -to 0 DDR_09_end_write
create_bd_port -dir O -from 1 -to 0 DDR_10_end_write
create_bd_port -dir O -from 1 -to 0 DDR_11_end_write
create_bd_port -dir O -from 1 -to 0 DDR_12_end_write
create_bd_port -dir O -from 1 -to 0 DDR_13_end_write
create_bd_port -dir O -from 1 -to 0 DDR_14_end_write
create_bd_port -dir O -from 1 -to 0 DDR_15_end_write
create_bd_port -dir O DDR_01_end_read
create_bd_port -dir O DDR_02_end_read
create_bd_port -dir O DDR_03_end_read
create_bd_port -dir O DDR_04_end_read
create_bd_port -dir O DDR_05_end_read
create_bd_port -dir O DDR_06_end_read
create_bd_port -dir O DDR_07_end_read
create_bd_port -dir O DDR_08_end_read
create_bd_port -dir O DDR_09_end_read
create_bd_port -dir O DDR_10_end_read
create_bd_port -dir O DDR_11_end_read
create_bd_port -dir O DDR_12_end_read
create_bd_port -dir O DDR_13_end_read
create_bd_port -dir O DDR_14_end_read
create_bd_port -dir O DDR_15_end_read
create_bd_port -dir O DDR_01_read_ready
create_bd_port -dir O DDR_01_write_resp
create_bd_port -dir O DDR_01_write_last
create_bd_port -dir O DDR_02_read_ready
create_bd_port -dir O DDR_02_write_resp
create_bd_port -dir O DDR_02_write_last
create_bd_port -dir O DDR_03_read_ready
create_bd_port -dir O DDR_03_write_resp
create_bd_port -dir O DDR_03_write_last
create_bd_port -dir O DDR_04_read_ready
create_bd_port -dir O DDR_04_write_resp
create_bd_port -dir O DDR_04_write_last
create_bd_port -dir O DDR_05_read_ready
create_bd_port -dir O DDR_05_write_resp
create_bd_port -dir O DDR_05_write_last
create_bd_port -dir O DDR_06_read_ready
create_bd_port -dir O DDR_06_write_resp
create_bd_port -dir O DDR_06_write_last
create_bd_port -dir O DDR_07_read_ready
create_bd_port -dir O DDR_07_write_resp
create_bd_port -dir O DDR_07_write_last
create_bd_port -dir O DDR_08_read_ready
create_bd_port -dir O DDR_08_write_resp
create_bd_port -dir O DDR_08_write_last
create_bd_port -dir O DDR_09_read_ready
create_bd_port -dir O DDR_09_write_resp
create_bd_port -dir O DDR_09_write_last
create_bd_port -dir O DDR_10_read_ready
create_bd_port -dir O DDR_10_write_resp
create_bd_port -dir O DDR_10_write_last
create_bd_port -dir O DDR_11_read_ready
create_bd_port -dir O DDR_11_write_resp
create_bd_port -dir O DDR_11_write_last
create_bd_port -dir O DDR_12_read_ready
create_bd_port -dir O DDR_12_write_resp
create_bd_port -dir O DDR_12_write_last
create_bd_port -dir O DDR_13_read_ready
create_bd_port -dir O DDR_13_write_resp
create_bd_port -dir O DDR_13_write_last
create_bd_port -dir O DDR_14_read_ready
create_bd_port -dir O DDR_14_write_resp
create_bd_port -dir O DDR_14_write_last
create_bd_port -dir O DDR_15_read_ready
create_bd_port -dir O DDR_15_write_resp
create_bd_port -dir O DDR_15_write_last
create_bd_port -dir I DDR_01_write_ready
create_bd_port -dir I -from 7 -to 0 DDR_01_wburst
create_bd_port -dir I -from 7 -to 0 DDR_01_rburst
create_bd_port -dir I DDR_02_write_ready
create_bd_port -dir I -from 7 -to 0 DDR_02_wburst
create_bd_port -dir I -from 7 -to 0 DDR_02_rburst
create_bd_port -dir I DDR_03_write_ready
create_bd_port -dir I -from 7 -to 0 DDR_03_wburst
create_bd_port -dir I -from 7 -to 0 DDR_03_rburst
create_bd_port -dir I DDR_04_write_ready
create_bd_port -dir I -from 7 -to 0 DDR_04_wburst
create_bd_port -dir I -from 7 -to 0 DDR_04_rburst
create_bd_port -dir I DDR_05_write_ready
create_bd_port -dir I -from 7 -to 0 DDR_05_wburst
create_bd_port -dir I -from 7 -to 0 DDR_05_rburst
create_bd_port -dir I DDR_06_write_ready
create_bd_port -dir I -from 7 -to 0 DDR_06_wburst
create_bd_port -dir I -from 7 -to 0 DDR_06_rburst
create_bd_port -dir I DDR_07_write_ready
create_bd_port -dir I -from 7 -to 0 DDR_07_wburst
create_bd_port -dir I -from 7 -to 0 DDR_07_rburst
create_bd_port -dir I DDR_08_write_ready
create_bd_port -dir I -from 7 -to 0 DDR_08_wburst
create_bd_port -dir I -from 7 -to 0 DDR_08_rburst
create_bd_port -dir I DDR_09_write_ready
create_bd_port -dir I -from 7 -to 0 DDR_09_wburst
create_bd_port -dir I -from 7 -to 0 DDR_09_rburst
create_bd_port -dir I DDR_10_write_ready
create_bd_port -dir I -from 7 -to 0 DDR_10_wburst
create_bd_port -dir I -from 7 -to 0 DDR_10_rburst
create_bd_port -dir I DDR_11_write_ready
create_bd_port -dir I -from 7 -to 0 DDR_11_wburst
create_bd_port -dir I -from 7 -to 0 DDR_11_rburst
create_bd_port -dir I DDR_12_write_ready
create_bd_port -dir I -from 7 -to 0 DDR_12_wburst
create_bd_port -dir I -from 7 -to 0 DDR_12_rburst
create_bd_port -dir I DDR_13_write_ready
create_bd_port -dir I -from 7 -to 0 DDR_13_wburst
create_bd_port -dir I -from 7 -to 0 DDR_13_rburst
create_bd_port -dir I DDR_14_write_ready
create_bd_port -dir I -from 7 -to 0 DDR_14_wburst
create_bd_port -dir I -from 7 -to 0 DDR_14_rburst
create_bd_port -dir I DDR_15_write_ready
create_bd_port -dir I -from 7 -to 0 DDR_15_wburst
create_bd_port -dir I -from 7 -to 0 DDR_15_rburst
create_bd_port -dir I HBM_01_start_write
create_bd_port -dir I HBM_01_start_read
create_bd_port -dir I -from 7 -to 0 HBM_01_rburst
create_bd_port -dir I -from 7 -to 0 HBM_01_wburst
create_bd_port -dir I -from 32 -to 0 HBM_01_write_addr
create_bd_port -dir I -from 32 -to 0 HBM_01_read_addr
create_bd_port -dir I HBM_01_write_ready
create_bd_port -dir I -from 255 -to 0 -type data HBM_01_write_data
create_bd_port -dir I HBM_02_start_write
create_bd_port -dir I HBM_02_start_read
create_bd_port -dir I -from 7 -to 0 HBM_02_rburst
create_bd_port -dir I -from 7 -to 0 HBM_02_wburst
create_bd_port -dir I -from 32 -to 0 HBM_02_write_addr
create_bd_port -dir I -from 32 -to 0 HBM_02_read_addr
create_bd_port -dir I HBM_02_write_ready
create_bd_port -dir I -from 255 -to 0 -type data HBM_02_write_data
create_bd_port -dir I HBM_03_start_write
create_bd_port -dir I HBM_03_start_read
create_bd_port -dir I -from 7 -to 0 HBM_03_rburst
create_bd_port -dir I -from 7 -to 0 HBM_03_wburst
create_bd_port -dir I -from 32 -to 0 HBM_03_write_addr
create_bd_port -dir I -from 32 -to 0 HBM_03_read_addr
create_bd_port -dir I HBM_03_write_ready
create_bd_port -dir I -from 255 -to 0 -type data HBM_03_write_data
create_bd_port -dir I HBM_04_start_write
create_bd_port -dir I HBM_04_start_read
create_bd_port -dir I -from 7 -to 0 HBM_04_rburst
create_bd_port -dir I -from 7 -to 0 HBM_04_wburst
create_bd_port -dir I -from 32 -to 0 HBM_04_write_addr
create_bd_port -dir I -from 32 -to 0 HBM_04_read_addr
create_bd_port -dir I HBM_04_write_ready
create_bd_port -dir I -from 255 -to 0 -type data HBM_04_write_data
create_bd_port -dir I HBM_05_start_write
create_bd_port -dir I HBM_05_start_read
create_bd_port -dir I -from 7 -to 0 HBM_05_rburst
create_bd_port -dir I -from 7 -to 0 HBM_05_wburst
create_bd_port -dir I -from 32 -to 0 HBM_05_write_addr
create_bd_port -dir I -from 32 -to 0 HBM_05_read_addr
create_bd_port -dir I HBM_05_write_ready
create_bd_port -dir I -from 255 -to 0 -type data HBM_05_write_data
create_bd_port -dir I HBM_06_start_write
create_bd_port -dir I HBM_06_start_read
create_bd_port -dir I -from 7 -to 0 HBM_06_rburst
create_bd_port -dir I -from 7 -to 0 HBM_06_wburst
create_bd_port -dir I -from 32 -to 0 HBM_06_write_addr
create_bd_port -dir I -from 32 -to 0 HBM_06_read_addr
create_bd_port -dir I HBM_06_write_ready
create_bd_port -dir I -from 255 -to 0 -type data HBM_06_write_data
create_bd_port -dir I HBM_07_start_write
create_bd_port -dir I HBM_07_start_read
create_bd_port -dir I -from 7 -to 0 HBM_07_rburst
create_bd_port -dir I -from 7 -to 0 HBM_07_wburst
create_bd_port -dir I -from 32 -to 0 HBM_07_write_addr
create_bd_port -dir I -from 32 -to 0 HBM_07_read_addr
create_bd_port -dir I HBM_07_write_ready
create_bd_port -dir I -from 255 -to 0 -type data HBM_07_write_data
create_bd_port -dir I HBM_08_start_write
create_bd_port -dir I HBM_08_start_read
create_bd_port -dir I -from 7 -to 0 HBM_08_rburst
create_bd_port -dir I -from 7 -to 0 HBM_08_wburst
create_bd_port -dir I -from 32 -to 0 HBM_08_write_addr
create_bd_port -dir I -from 32 -to 0 HBM_08_read_addr
create_bd_port -dir I HBM_08_write_ready
create_bd_port -dir I -from 255 -to 0 -type data HBM_08_write_data
create_bd_port -dir I HBM_09_start_write
create_bd_port -dir I HBM_09_start_read
create_bd_port -dir I -from 7 -to 0 HBM_09_rburst
create_bd_port -dir I -from 7 -to 0 HBM_09_wburst
create_bd_port -dir I -from 32 -to 0 HBM_09_write_addr
create_bd_port -dir I -from 32 -to 0 HBM_09_read_addr
create_bd_port -dir I HBM_09_write_ready
create_bd_port -dir I -from 255 -to 0 -type data HBM_09_write_data
create_bd_port -dir I HBM_10_start_write
create_bd_port -dir I HBM_10_start_read
create_bd_port -dir I -from 7 -to 0 HBM_10_rburst
create_bd_port -dir I -from 7 -to 0 HBM_10_wburst
create_bd_port -dir I -from 32 -to 0 HBM_10_write_addr
create_bd_port -dir I -from 32 -to 0 HBM_10_read_addr
create_bd_port -dir I HBM_10_write_ready
create_bd_port -dir I -from 255 -to 0 -type data HBM_10_write_data
create_bd_port -dir I HBM_11_start_write
create_bd_port -dir I HBM_11_start_read
create_bd_port -dir I -from 7 -to 0 HBM_11_rburst
create_bd_port -dir I -from 7 -to 0 HBM_11_wburst
create_bd_port -dir I -from 32 -to 0 HBM_11_write_addr
create_bd_port -dir I -from 32 -to 0 HBM_11_read_addr
create_bd_port -dir I HBM_11_write_ready
create_bd_port -dir I -from 255 -to 0 -type data HBM_11_write_data
create_bd_port -dir I HBM_12_start_write
create_bd_port -dir I HBM_12_start_read
create_bd_port -dir I -from 7 -to 0 HBM_12_rburst
create_bd_port -dir I -from 7 -to 0 HBM_12_wburst
create_bd_port -dir I -from 32 -to 0 HBM_12_write_addr
create_bd_port -dir I -from 32 -to 0 HBM_12_read_addr
create_bd_port -dir I HBM_12_write_ready
create_bd_port -dir I -from 255 -to 0 -type data HBM_12_write_data
create_bd_port -dir I HBM_13_start_write
create_bd_port -dir I HBM_13_start_read
create_bd_port -dir I -from 7 -to 0 HBM_13_rburst
create_bd_port -dir I -from 7 -to 0 HBM_13_wburst
create_bd_port -dir I -from 32 -to 0 HBM_13_write_addr
create_bd_port -dir I -from 32 -to 0 HBM_13_read_addr
create_bd_port -dir I HBM_13_write_ready
create_bd_port -dir I -from 255 -to 0 -type data HBM_13_write_data
create_bd_port -dir I HBM_14_start_write
create_bd_port -dir I HBM_14_start_read
create_bd_port -dir I -from 7 -to 0 HBM_14_rburst
create_bd_port -dir I -from 7 -to 0 HBM_14_wburst
create_bd_port -dir I -from 32 -to 0 HBM_14_write_addr
create_bd_port -dir I -from 32 -to 0 HBM_14_read_addr
create_bd_port -dir I HBM_14_write_ready
create_bd_port -dir I -from 255 -to 0 -type data HBM_14_write_data
create_bd_port -dir I HBM_15_start_write
create_bd_port -dir I HBM_15_start_read
create_bd_port -dir I -from 7 -to 0 HBM_15_rburst
create_bd_port -dir I -from 7 -to 0 HBM_15_wburst
create_bd_port -dir I -from 32 -to 0 HBM_15_write_addr
create_bd_port -dir I -from 32 -to 0 HBM_15_read_addr
create_bd_port -dir I HBM_15_write_ready
create_bd_port -dir I -from 255 -to 0 -type data HBM_15_write_data
create_bd_port -dir O -from 1 -to 0 HBM_01_end_write
create_bd_port -dir O HBM_01_end_read
create_bd_port -dir O HBM_01_write_resp
create_bd_port -dir O HBM_01_write_last
create_bd_port -dir O HBM_01_read_ready
create_bd_port -dir O -from 255 -to 0 -type data HBM_01_read_data
create_bd_port -dir O -from 1 -to 0 HBM_02_end_write
create_bd_port -dir O HBM_02_end_read
create_bd_port -dir O HBM_02_write_resp
create_bd_port -dir O HBM_02_write_last
create_bd_port -dir O HBM_02_read_ready
create_bd_port -dir O -from 255 -to 0 -type data HBM_02_read_data
create_bd_port -dir O -from 1 -to 0 HBM_03_end_write
create_bd_port -dir O HBM_03_end_read
create_bd_port -dir O HBM_03_write_resp
create_bd_port -dir O HBM_03_write_last
create_bd_port -dir O HBM_03_read_ready
create_bd_port -dir O -from 255 -to 0 -type data HBM_03_read_data
create_bd_port -dir O -from 1 -to 0 HBM_04_end_write
create_bd_port -dir O HBM_04_end_read
create_bd_port -dir O HBM_04_write_resp
create_bd_port -dir O HBM_04_write_last
create_bd_port -dir O HBM_04_read_ready
create_bd_port -dir O -from 255 -to 0 -type data HBM_04_read_data
create_bd_port -dir O -from 1 -to 0 HBM_05_end_write
create_bd_port -dir O HBM_05_end_read
create_bd_port -dir O HBM_05_write_resp
create_bd_port -dir O HBM_05_write_last
create_bd_port -dir O HBM_05_read_ready
create_bd_port -dir O -from 255 -to 0 -type data HBM_05_read_data
create_bd_port -dir O -from 1 -to 0 HBM_06_end_write
create_bd_port -dir O HBM_06_end_read
create_bd_port -dir O HBM_06_write_resp
create_bd_port -dir O HBM_06_write_last
create_bd_port -dir O HBM_06_read_ready
create_bd_port -dir O -from 255 -to 0 -type data HBM_06_read_data
create_bd_port -dir O -from 1 -to 0 HBM_07_end_write
create_bd_port -dir O HBM_07_end_read
create_bd_port -dir O HBM_07_write_resp
create_bd_port -dir O HBM_07_write_last
create_bd_port -dir O HBM_07_read_ready
create_bd_port -dir O -from 255 -to 0 -type data HBM_07_read_data
create_bd_port -dir O -from 1 -to 0 HBM_08_end_write
create_bd_port -dir O HBM_08_end_read
create_bd_port -dir O HBM_08_write_resp
create_bd_port -dir O HBM_08_write_last
create_bd_port -dir O HBM_08_read_ready
create_bd_port -dir O -from 255 -to 0 -type data HBM_08_read_data
create_bd_port -dir O -from 1 -to 0 HBM_09_end_write
create_bd_port -dir O HBM_09_end_read
create_bd_port -dir O HBM_09_write_resp
create_bd_port -dir O HBM_09_write_last
create_bd_port -dir O HBM_09_read_ready
create_bd_port -dir O -from 255 -to 0 -type data HBM_09_read_data
create_bd_port -dir O -from 1 -to 0 HBM_10_end_write
create_bd_port -dir O HBM_10_end_read
create_bd_port -dir O HBM_10_write_resp
create_bd_port -dir O HBM_10_write_last
create_bd_port -dir O HBM_10_read_ready
create_bd_port -dir O -from 255 -to 0 -type data HBM_10_read_data
create_bd_port -dir O -from 1 -to 0 HBM_11_end_write
create_bd_port -dir O HBM_11_end_read
create_bd_port -dir O HBM_11_write_resp
create_bd_port -dir O HBM_11_write_last
create_bd_port -dir O HBM_11_read_ready
create_bd_port -dir O -from 255 -to 0 -type data HBM_11_read_data
create_bd_port -dir O -from 1 -to 0 HBM_12_end_write
create_bd_port -dir O HBM_12_end_read
create_bd_port -dir O HBM_12_write_resp
create_bd_port -dir O HBM_12_write_last
create_bd_port -dir O HBM_12_read_ready
create_bd_port -dir O -from 255 -to 0 -type data HBM_12_read_data
create_bd_port -dir O -from 1 -to 0 HBM_13_end_write
create_bd_port -dir O HBM_13_end_read
create_bd_port -dir O HBM_13_write_resp
create_bd_port -dir O HBM_13_write_last
create_bd_port -dir O HBM_13_read_ready
create_bd_port -dir O -from 255 -to 0 -type data HBM_13_read_data
create_bd_port -dir O -from 1 -to 0 HBM_14_end_write
create_bd_port -dir O HBM_14_end_read
create_bd_port -dir O HBM_14_write_resp
create_bd_port -dir O HBM_14_write_last
create_bd_port -dir O HBM_14_read_ready
create_bd_port -dir O -from 255 -to 0 -type data HBM_14_read_data
create_bd_port -dir O -from 1 -to 0 HBM_15_end_write
create_bd_port -dir O HBM_15_end_read
create_bd_port -dir O HBM_15_write_resp
create_bd_port -dir O HBM_15_write_last
create_bd_port -dir O HBM_15_read_ready
create_bd_port -dir O -from 255 -to 0 -type data HBM_15_read_data

create_bd_cell -type ip -vlnv xilinx.com:ip:axi_vip:1.1 HBMVIP0
set_property -dict {CONFIG.ADDR_WIDTH 33 CONFIG.DATA_WIDTH 256 CONFIG.INTERFACE_MODE SLAVE} [get_bd_cells HBMVIP0]
create_bd_cell -type ip -vlnv xilinx.com:ip:axi_vip:1.1 DDRVIP
set_property -dict {CONFIG.ADDR_WIDTH 34 CONFIG.DATA_WIDTH 512 CONFIG.INTERFACE_MODE SLAVE} [get_bd_cells DDRVIP]
create_bd_cell -type ip -vlnv user.org:user:AXI_Engine:2.0 DDR_00_AXI_Engine
set_property -dict {CONFIG.ADDR_WIDTH 34 CONFIG.DATA_WIDTH 512} [get_bd_cells DDR_00_AXI_Engine]
create_bd_cell -type ip -vlnv user.org:user:AXI_Engine:2.0 HBM_00_AXI_Engine
create_bd_cell -type ip -vlnv xilinx.com:ip:axi_vip:1.1 HBMVIP1
set_property -dict {CONFIG.ADDR_WIDTH 33 CONFIG.DATA_WIDTH 256 CONFIG.INTERFACE_MODE SLAVE} [get_bd_cells HBMVIP1]
create_bd_cell -type ip -vlnv user.org:user:AXI_Engine:2.0 HBM_01_AXI_Engine
create_bd_cell -type ip -vlnv xilinx.com:ip:axi_vip:1.1 HBMVIP2
set_property -dict {CONFIG.ADDR_WIDTH 33 CONFIG.DATA_WIDTH 256 CONFIG.INTERFACE_MODE SLAVE} [get_bd_cells HBMVIP2]
create_bd_cell -type ip -vlnv user.org:user:AXI_Engine:2.0 HBM_02_AXI_Engine
create_bd_cell -type ip -vlnv xilinx.com:ip:axi_vip:1.1 HBMVIP3
set_property -dict {CONFIG.ADDR_WIDTH 33 CONFIG.DATA_WIDTH 256 CONFIG.INTERFACE_MODE SLAVE} [get_bd_cells HBMVIP3]
create_bd_cell -type ip -vlnv user.org:user:AXI_Engine:2.0 HBM_03_AXI_Engine
create_bd_cell -type ip -vlnv xilinx.com:ip:axi_vip:1.1 HBMVIP4
set_property -dict {CONFIG.ADDR_WIDTH 33 CONFIG.DATA_WIDTH 256 CONFIG.INTERFACE_MODE SLAVE} [get_bd_cells HBMVIP4]
create_bd_cell -type ip -vlnv user.org:user:AXI_Engine:2.0 HBM_04_AXI_Engine
create_bd_cell -type ip -vlnv xilinx.com:ip:axi_vip:1.1 HBMVIP5
set_property -dict {CONFIG.ADDR_WIDTH 33 CONFIG.DATA_WIDTH 256 CONFIG.INTERFACE_MODE SLAVE} [get_bd_cells HBMVIP5]
create_bd_cell -type ip -vlnv user.org:user:AXI_Engine:2.0 HBM_05_AXI_Engine
create_bd_cell -type ip -vlnv xilinx.com:ip:axi_vip:1.1 HBMVIP6
set_property -dict {CONFIG.ADDR_WIDTH 33 CONFIG.DATA_WIDTH 256 CONFIG.INTERFACE_MODE SLAVE} [get_bd_cells HBMVIP6]
create_bd_cell -type ip -vlnv user.org:user:AXI_Engine:2.0 HBM_06_AXI_Engine
create_bd_cell -type ip -vlnv xilinx.com:ip:axi_vip:1.1 HBMVIP7
set_property -dict {CONFIG.ADDR_WIDTH 33 CONFIG.DATA_WIDTH 256 CONFIG.INTERFACE_MODE SLAVE} [get_bd_cells HBMVIP7]
create_bd_cell -type ip -vlnv user.org:user:AXI_Engine:2.0 HBM_07_AXI_Engine
create_bd_cell -type ip -vlnv xilinx.com:ip:axi_vip:1.1 HBMVIP8
set_property -dict {CONFIG.ADDR_WIDTH 33 CONFIG.DATA_WIDTH 256 CONFIG.INTERFACE_MODE SLAVE} [get_bd_cells HBMVIP8]
create_bd_cell -type ip -vlnv user.org:user:AXI_Engine:2.0 HBM_08_AXI_Engine
create_bd_cell -type ip -vlnv xilinx.com:ip:axi_vip:1.1 HBMVIP9
set_property -dict {CONFIG.ADDR_WIDTH 33 CONFIG.DATA_WIDTH 256 CONFIG.INTERFACE_MODE SLAVE} [get_bd_cells HBMVIP9]
create_bd_cell -type ip -vlnv user.org:user:AXI_Engine:2.0 HBM_09_AXI_Engine
create_bd_cell -type ip -vlnv xilinx.com:ip:axi_vip:1.1 HBMVIP10
set_property -dict {CONFIG.ADDR_WIDTH 33 CONFIG.DATA_WIDTH 256 CONFIG.INTERFACE_MODE SLAVE} [get_bd_cells HBMVIP10]
create_bd_cell -type ip -vlnv user.org:user:AXI_Engine:2.0 HBM_10_AXI_Engine
create_bd_cell -type ip -vlnv xilinx.com:ip:axi_vip:1.1 HBMVIP11
set_property -dict {CONFIG.ADDR_WIDTH 33 CONFIG.DATA_WIDTH 256 CONFIG.INTERFACE_MODE SLAVE} [get_bd_cells HBMVIP11]
create_bd_cell -type ip -vlnv user.org:user:AXI_Engine:2.0 HBM_11_AXI_Engine
create_bd_cell -type ip -vlnv xilinx.com:ip:axi_vip:1.1 HBMVIP12
set_property -dict {CONFIG.ADDR_WIDTH 33 CONFIG.DATA_WIDTH 256 CONFIG.INTERFACE_MODE SLAVE} [get_bd_cells HBMVIP12]
create_bd_cell -type ip -vlnv user.org:user:AXI_Engine:2.0 HBM_12_AXI_Engine
create_bd_cell -type ip -vlnv xilinx.com:ip:axi_vip:1.1 HBMVIP13
set_property -dict {CONFIG.ADDR_WIDTH 33 CONFIG.DATA_WIDTH 256 CONFIG.INTERFACE_MODE SLAVE} [get_bd_cells HBMVIP13]
create_bd_cell -type ip -vlnv user.org:user:AXI_Engine:2.0 HBM_13_AXI_Engine
create_bd_cell -type ip -vlnv xilinx.com:ip:axi_vip:1.1 HBMVIP14
set_property -dict {CONFIG.ADDR_WIDTH 33 CONFIG.DATA_WIDTH 256 CONFIG.INTERFACE_MODE SLAVE} [get_bd_cells HBMVIP14]
create_bd_cell -type ip -vlnv user.org:user:AXI_Engine:2.0 HBM_14_AXI_Engine
create_bd_cell -type ip -vlnv xilinx.com:ip:axi_vip:1.1 HBMVIP15
set_property -dict {CONFIG.ADDR_WIDTH 33 CONFIG.DATA_WIDTH 256 CONFIG.INTERFACE_MODE SLAVE} [get_bd_cells HBMVIP15]
create_bd_cell -type ip -vlnv user.org:user:AXI_Engine:2.0 HBM_15_AXI_Engine
create_bd_cell -type ip -vlnv user.org:user:AXI_Engine:2.0 DDR_01_AXI_Engine
set_property -dict {CONFIG.ADDR_WIDTH 34 CONFIG.DATA_WIDTH 512} [get_bd_cells DDR_01_AXI_Engine]
create_bd_cell -type ip -vlnv user.org:user:AXI_Engine:2.0 DDR_02_AXI_Engine
set_property -dict {CONFIG.ADDR_WIDTH 34 CONFIG.DATA_WIDTH 512} [get_bd_cells DDR_02_AXI_Engine]
create_bd_cell -type ip -vlnv user.org:user:AXI_Engine:2.0 DDR_03_AXI_Engine
set_property -dict {CONFIG.ADDR_WIDTH 34 CONFIG.DATA_WIDTH 512} [get_bd_cells DDR_03_AXI_Engine]
create_bd_cell -type ip -vlnv user.org:user:AXI_Engine:2.0 DDR_04_AXI_Engine
set_property -dict {CONFIG.ADDR_WIDTH 34 CONFIG.DATA_WIDTH 512} [get_bd_cells DDR_04_AXI_Engine]
create_bd_cell -type ip -vlnv user.org:user:AXI_Engine:2.0 DDR_05_AXI_Engine
set_property -dict {CONFIG.ADDR_WIDTH 34 CONFIG.DATA_WIDTH 512} [get_bd_cells DDR_05_AXI_Engine]
create_bd_cell -type ip -vlnv user.org:user:AXI_Engine:2.0 DDR_06_AXI_Engine
set_property -dict {CONFIG.ADDR_WIDTH 34 CONFIG.DATA_WIDTH 512} [get_bd_cells DDR_06_AXI_Engine]
create_bd_cell -type ip -vlnv user.org:user:AXI_Engine:2.0 DDR_07_AXI_Engine
set_property -dict {CONFIG.ADDR_WIDTH 34 CONFIG.DATA_WIDTH 512} [get_bd_cells DDR_07_AXI_Engine]
create_bd_cell -type ip -vlnv user.org:user:AXI_Engine:2.0 DDR_08_AXI_Engine
set_property -dict {CONFIG.ADDR_WIDTH 34 CONFIG.DATA_WIDTH 512} [get_bd_cells DDR_08_AXI_Engine]
create_bd_cell -type ip -vlnv user.org:user:AXI_Engine:2.0 DDR_09_AXI_Engine
set_property -dict {CONFIG.ADDR_WIDTH 34 CONFIG.DATA_WIDTH 512} [get_bd_cells DDR_09_AXI_Engine]
create_bd_cell -type ip -vlnv user.org:user:AXI_Engine:2.0 DDR_10_AXI_Engine
set_property -dict {CONFIG.ADDR_WIDTH 34 CONFIG.DATA_WIDTH 512} [get_bd_cells DDR_10_AXI_Engine]
create_bd_cell -type ip -vlnv user.org:user:AXI_Engine:2.0 DDR_11_AXI_Engine
set_property -dict {CONFIG.ADDR_WIDTH 34 CONFIG.DATA_WIDTH 512} [get_bd_cells DDR_11_AXI_Engine]
create_bd_cell -type ip -vlnv user.org:user:AXI_Engine:2.0 DDR_12_AXI_Engine
set_property -dict {CONFIG.ADDR_WIDTH 34 CONFIG.DATA_WIDTH 512} [get_bd_cells DDR_12_AXI_Engine]
create_bd_cell -type ip -vlnv user.org:user:AXI_Engine:2.0 DDR_13_AXI_Engine
set_property -dict {CONFIG.ADDR_WIDTH 34 CONFIG.DATA_WIDTH 512} [get_bd_cells DDR_13_AXI_Engine]
create_bd_cell -type ip -vlnv user.org:user:AXI_Engine:2.0 DDR_14_AXI_Engine
set_property -dict {CONFIG.ADDR_WIDTH 34 CONFIG.DATA_WIDTH 512} [get_bd_cells DDR_14_AXI_Engine]
create_bd_cell -type ip -vlnv user.org:user:AXI_Engine:2.0 DDR_15_AXI_Engine
set_property -dict {CONFIG.ADDR_WIDTH 34 CONFIG.DATA_WIDTH 512} [get_bd_cells DDR_15_AXI_Engine]
create_bd_cell -type ip -vlnv xilinx.com:ip:smartconnect:1.0 smartconnect_0
set_property -dict {CONFIG.NUM_SI 16} [get_bd_cells smartconnect_0]

# ---- connections ----

connect_bd_intf_net [get_bd_intf_pins DDR_00_AXI_Engine/m_axi] [get_bd_intf_pins smartconnect_0/S00_AXI]
connect_bd_intf_net [get_bd_intf_pins DDR_01_AXI_Engine/m_axi] [get_bd_intf_pins smartconnect_0/S01_AXI]
connect_bd_intf_net [get_bd_intf_pins DDR_02_AXI_Engine/m_axi] [get_bd_intf_pins smartconnect_0/S02_AXI]
connect_bd_intf_net [get_bd_intf_pins DDR_03_AXI_Engine/m_axi] [get_bd_intf_pins smartconnect_0/S03_AXI]
connect_bd_intf_net [get_bd_intf_pins DDR_04_AXI_Engine/m_axi] [get_bd_intf_pins smartconnect_0/S04_AXI]
connect_bd_intf_net [get_bd_intf_pins DDR_05_AXI_Engine/m_axi] [get_bd_intf_pins smartconnect_0/S05_AXI]
connect_bd_intf_net [get_bd_intf_pins DDR_06_AXI_Engine/m_axi] [get_bd_intf_pins smartconnect_0/S06_AXI]
connect_bd_intf_net [get_bd_intf_pins DDR_07_AXI_Engine/m_axi] [get_bd_intf_pins smartconnect_0/S07_AXI]
connect_bd_intf_net [get_bd_intf_pins DDR_08_AXI_Engine/m_axi] [get_bd_intf_pins smartconnect_0/S08_AXI]
connect_bd_intf_net [get_bd_intf_pins DDR_09_AXI_Engine/m_axi] [get_bd_intf_pins smartconnect_0/S09_AXI]
connect_bd_intf_net [get_bd_intf_pins DDR_10_AXI_Engine/m_axi] [get_bd_intf_pins smartconnect_0/S10_AXI]
connect_bd_intf_net [get_bd_intf_pins DDR_11_AXI_Engine/m_axi] [get_bd_intf_pins smartconnect_0/S11_AXI]
connect_bd_intf_net [get_bd_intf_pins DDR_12_AXI_Engine/m_axi] [get_bd_intf_pins smartconnect_0/S12_AXI]
connect_bd_intf_net [get_bd_intf_pins DDR_13_AXI_Engine/m_axi] [get_bd_intf_pins smartconnect_0/S13_AXI]
connect_bd_intf_net [get_bd_intf_pins DDR_14_AXI_Engine/m_axi] [get_bd_intf_pins smartconnect_0/S14_AXI]
connect_bd_intf_net [get_bd_intf_pins DDR_15_AXI_Engine/m_axi] [get_bd_intf_pins smartconnect_0/S15_AXI]
connect_bd_intf_net [get_bd_intf_pins HBM_00_AXI_Engine/m_axi] [get_bd_intf_pins HBMVIP0/S_AXI]
connect_bd_intf_net [get_bd_intf_pins HBMVIP1/S_AXI] [get_bd_intf_pins HBM_01_AXI_Engine/m_axi]
connect_bd_intf_net [get_bd_intf_pins HBMVIP2/S_AXI] [get_bd_intf_pins HBM_02_AXI_Engine/m_axi]
connect_bd_intf_net [get_bd_intf_pins HBMVIP3/S_AXI] [get_bd_intf_pins HBM_03_AXI_Engine/m_axi]
connect_bd_intf_net [get_bd_intf_pins HBMVIP4/S_AXI] [get_bd_intf_pins HBM_04_AXI_Engine/m_axi]
connect_bd_intf_net [get_bd_intf_pins HBMVIP5/S_AXI] [get_bd_intf_pins HBM_05_AXI_Engine/m_axi]
connect_bd_intf_net [get_bd_intf_pins HBMVIP6/S_AXI] [get_bd_intf_pins HBM_06_AXI_Engine/m_axi]
connect_bd_intf_net [get_bd_intf_pins HBMVIP7/S_AXI] [get_bd_intf_pins HBM_07_AXI_Engine/m_axi]
connect_bd_intf_net [get_bd_intf_pins HBMVIP8/S_AXI] [get_bd_intf_pins HBM_08_AXI_Engine/m_axi]
connect_bd_intf_net [get_bd_intf_pins HBMVIP9/S_AXI] [get_bd_intf_pins HBM_09_AXI_Engine/m_axi]
connect_bd_intf_net [get_bd_intf_pins HBMVIP10/S_AXI] [get_bd_intf_pins HBM_10_AXI_Engine/m_axi]
connect_bd_intf_net [get_bd_intf_pins HBMVIP11/S_AXI] [get_bd_intf_pins HBM_11_AXI_Engine/m_axi]
connect_bd_intf_net [get_bd_intf_pins HBMVIP12/S_AXI] [get_bd_intf_pins HBM_12_AXI_Engine/m_axi]
connect_bd_intf_net [get_bd_intf_pins HBMVIP13/S_AXI] [get_bd_intf_pins HBM_13_AXI_Engine/m_axi]
connect_bd_intf_net [get_bd_intf_pins HBMVIP14/S_AXI] [get_bd_intf_pins HBM_14_AXI_Engine/m_axi]
connect_bd_intf_net [get_bd_intf_pins HBMVIP15/S_AXI] [get_bd_intf_pins HBM_15_AXI_Engine/m_axi]
connect_bd_intf_net [get_bd_intf_pins smartconnect_0/M00_AXI] [get_bd_intf_pins DDRVIP/S_AXI]
connect_bd_net [get_bd_pins DDR_00_AXI_Engine/end_rd] [get_bd_ports DDR_00_end_read]
connect_bd_net [get_bd_pins DDR_00_AXI_Engine/end_wr] [get_bd_ports DDR_00_end_write]
connect_bd_net [get_bd_pins DDR_00_AXI_Engine/read_data] [get_bd_ports DDR_00_read_data]
connect_bd_net [get_bd_pins DDR_00_AXI_Engine/read_ready] [get_bd_ports DDR_00_read_ready]
connect_bd_net [get_bd_pins DDR_00_AXI_Engine/write_last] [get_bd_ports DDR_00_write_last]
connect_bd_net [get_bd_pins DDR_00_AXI_Engine/write_resp] [get_bd_ports DDR_00_write_resp]
connect_bd_net [get_bd_ports DDR_00_rburst] [get_bd_pins DDR_00_AXI_Engine/rburst]
connect_bd_net [get_bd_ports DDR_00_read_addr] [get_bd_pins DDR_00_AXI_Engine/read_addr]
connect_bd_net [get_bd_ports DDR_00_start_read] [get_bd_pins DDR_00_AXI_Engine/start_rd]
connect_bd_net [get_bd_ports DDR_00_start_write] [get_bd_pins DDR_00_AXI_Engine/start_wr]
connect_bd_net [get_bd_ports DDR_00_wburst] [get_bd_pins DDR_00_AXI_Engine/wburst]
connect_bd_net [get_bd_ports DDR_00_write_addr] [get_bd_pins DDR_00_AXI_Engine/write_addr]
connect_bd_net [get_bd_ports DDR_00_write_data] [get_bd_pins DDR_00_AXI_Engine/write_data]
connect_bd_net [get_bd_ports DDR_00_write_ready] [get_bd_pins DDR_00_AXI_Engine/write_ready]
connect_bd_net [get_bd_pins DDR_01_AXI_Engine/end_rd] [get_bd_ports DDR_01_end_read]
connect_bd_net [get_bd_pins DDR_01_AXI_Engine/end_wr] [get_bd_ports DDR_01_end_write]
connect_bd_net [get_bd_pins DDR_01_AXI_Engine/read_data] [get_bd_ports DDR_01_read_data]
connect_bd_net [get_bd_pins DDR_01_AXI_Engine/read_ready] [get_bd_ports DDR_01_read_ready]
connect_bd_net [get_bd_pins DDR_01_AXI_Engine/write_last] [get_bd_ports DDR_01_write_last]
connect_bd_net [get_bd_pins DDR_01_AXI_Engine/write_resp] [get_bd_ports DDR_01_write_resp]
connect_bd_net [get_bd_ports DDR_01_rburst] [get_bd_pins DDR_01_AXI_Engine/rburst]
connect_bd_net [get_bd_ports DDR_01_read_addr] [get_bd_pins DDR_01_AXI_Engine/read_addr]
connect_bd_net [get_bd_ports DDR_01_start_read] [get_bd_pins DDR_01_AXI_Engine/start_rd]
connect_bd_net [get_bd_ports DDR_01_start_write] [get_bd_pins DDR_01_AXI_Engine/start_wr]
connect_bd_net [get_bd_ports DDR_01_wburst] [get_bd_pins DDR_01_AXI_Engine/wburst]
connect_bd_net [get_bd_ports DDR_01_write_addr] [get_bd_pins DDR_01_AXI_Engine/write_addr]
connect_bd_net [get_bd_ports DDR_01_write_data] [get_bd_pins DDR_01_AXI_Engine/write_data]
connect_bd_net [get_bd_ports DDR_01_write_ready] [get_bd_pins DDR_01_AXI_Engine/write_ready]
connect_bd_net [get_bd_pins DDR_02_AXI_Engine/end_rd] [get_bd_ports DDR_02_end_read]
connect_bd_net [get_bd_pins DDR_02_AXI_Engine/end_wr] [get_bd_ports DDR_02_end_write]
connect_bd_net [get_bd_pins DDR_02_AXI_Engine/read_data] [get_bd_ports DDR_02_read_data]
connect_bd_net [get_bd_pins DDR_02_AXI_Engine/read_ready] [get_bd_ports DDR_02_read_ready]
connect_bd_net [get_bd_pins DDR_02_AXI_Engine/write_last] [get_bd_ports DDR_02_write_last]
connect_bd_net [get_bd_pins DDR_02_AXI_Engine/write_resp] [get_bd_ports DDR_02_write_resp]
connect_bd_net [get_bd_ports DDR_02_rburst] [get_bd_pins DDR_02_AXI_Engine/rburst]
connect_bd_net [get_bd_ports DDR_02_read_addr] [get_bd_pins DDR_02_AXI_Engine/read_addr]
connect_bd_net [get_bd_ports DDR_02_start_read] [get_bd_pins DDR_02_AXI_Engine/start_rd]
connect_bd_net [get_bd_ports DDR_02_start_write] [get_bd_pins DDR_02_AXI_Engine/start_wr]
connect_bd_net [get_bd_ports DDR_02_wburst] [get_bd_pins DDR_02_AXI_Engine/wburst]
connect_bd_net [get_bd_ports DDR_02_write_addr] [get_bd_pins DDR_02_AXI_Engine/write_addr]
connect_bd_net [get_bd_ports DDR_02_write_data] [get_bd_pins DDR_02_AXI_Engine/write_data]
connect_bd_net [get_bd_ports DDR_02_write_ready] [get_bd_pins DDR_02_AXI_Engine/write_ready]
connect_bd_net [get_bd_pins DDR_03_AXI_Engine/end_rd] [get_bd_ports DDR_03_end_read]
connect_bd_net [get_bd_pins DDR_03_AXI_Engine/end_wr] [get_bd_ports DDR_03_end_write]
connect_bd_net [get_bd_pins DDR_03_AXI_Engine/read_data] [get_bd_ports DDR_03_read_data]
connect_bd_net [get_bd_pins DDR_03_AXI_Engine/read_ready] [get_bd_ports DDR_03_read_ready]
connect_bd_net [get_bd_pins DDR_03_AXI_Engine/write_last] [get_bd_ports DDR_03_write_last]
connect_bd_net [get_bd_pins DDR_03_AXI_Engine/write_resp] [get_bd_ports DDR_03_write_resp]
connect_bd_net [get_bd_ports DDR_03_rburst] [get_bd_pins DDR_03_AXI_Engine/rburst]
connect_bd_net [get_bd_ports DDR_03_read_addr] [get_bd_pins DDR_03_AXI_Engine/read_addr]
connect_bd_net [get_bd_ports DDR_03_start_read] [get_bd_pins DDR_03_AXI_Engine/start_rd]
connect_bd_net [get_bd_ports DDR_03_start_write] [get_bd_pins DDR_03_AXI_Engine/start_wr]
connect_bd_net [get_bd_ports DDR_03_wburst] [get_bd_pins DDR_03_AXI_Engine/wburst]
connect_bd_net [get_bd_ports DDR_03_write_addr] [get_bd_pins DDR_03_AXI_Engine/write_addr]
connect_bd_net [get_bd_ports DDR_03_write_data] [get_bd_pins DDR_03_AXI_Engine/write_data]
connect_bd_net [get_bd_ports DDR_03_write_ready] [get_bd_pins DDR_03_AXI_Engine/write_ready]
connect_bd_net [get_bd_pins DDR_04_AXI_Engine/end_rd] [get_bd_ports DDR_04_end_read]
connect_bd_net [get_bd_pins DDR_04_AXI_Engine/end_wr] [get_bd_ports DDR_04_end_write]
connect_bd_net [get_bd_pins DDR_04_AXI_Engine/read_data] [get_bd_ports DDR_04_read_data]
connect_bd_net [get_bd_pins DDR_04_AXI_Engine/read_ready] [get_bd_ports DDR_04_read_ready]
connect_bd_net [get_bd_pins DDR_04_AXI_Engine/write_last] [get_bd_ports DDR_04_write_last]
connect_bd_net [get_bd_pins DDR_04_AXI_Engine/write_resp] [get_bd_ports DDR_04_write_resp]
connect_bd_net [get_bd_ports DDR_04_rburst] [get_bd_pins DDR_04_AXI_Engine/rburst]
connect_bd_net [get_bd_ports DDR_04_read_addr] [get_bd_pins DDR_04_AXI_Engine/read_addr]
connect_bd_net [get_bd_ports DDR_04_start_read] [get_bd_pins DDR_04_AXI_Engine/start_rd]
connect_bd_net [get_bd_ports DDR_04_start_write] [get_bd_pins DDR_04_AXI_Engine/start_wr]
connect_bd_net [get_bd_ports DDR_04_wburst] [get_bd_pins DDR_04_AXI_Engine/wburst]
connect_bd_net [get_bd_ports DDR_04_write_addr] [get_bd_pins DDR_04_AXI_Engine/write_addr]
connect_bd_net [get_bd_ports DDR_04_write_data] [get_bd_pins DDR_04_AXI_Engine/write_data]
connect_bd_net [get_bd_ports DDR_04_write_ready] [get_bd_pins DDR_04_AXI_Engine/write_ready]
connect_bd_net [get_bd_pins DDR_05_AXI_Engine/end_rd] [get_bd_ports DDR_05_end_read]
connect_bd_net [get_bd_pins DDR_05_AXI_Engine/end_wr] [get_bd_ports DDR_05_end_write]
connect_bd_net [get_bd_pins DDR_05_AXI_Engine/read_data] [get_bd_ports DDR_05_read_data]
connect_bd_net [get_bd_pins DDR_05_AXI_Engine/read_ready] [get_bd_ports DDR_05_read_ready]
connect_bd_net [get_bd_pins DDR_05_AXI_Engine/write_last] [get_bd_ports DDR_05_write_last]
connect_bd_net [get_bd_pins DDR_05_AXI_Engine/write_resp] [get_bd_ports DDR_05_write_resp]
connect_bd_net [get_bd_ports DDR_05_rburst] [get_bd_pins DDR_05_AXI_Engine/rburst]
connect_bd_net [get_bd_ports DDR_05_read_addr] [get_bd_pins DDR_05_AXI_Engine/read_addr]
connect_bd_net [get_bd_ports DDR_05_start_read] [get_bd_pins DDR_05_AXI_Engine/start_rd]
connect_bd_net [get_bd_ports DDR_05_start_write] [get_bd_pins DDR_05_AXI_Engine/start_wr]
connect_bd_net [get_bd_ports DDR_05_wburst] [get_bd_pins DDR_05_AXI_Engine/wburst]
connect_bd_net [get_bd_ports DDR_05_write_addr] [get_bd_pins DDR_05_AXI_Engine/write_addr]
connect_bd_net [get_bd_ports DDR_05_write_data] [get_bd_pins DDR_05_AXI_Engine/write_data]
connect_bd_net [get_bd_ports DDR_05_write_ready] [get_bd_pins DDR_05_AXI_Engine/write_ready]
connect_bd_net [get_bd_pins DDR_06_AXI_Engine/end_rd] [get_bd_ports DDR_06_end_read]
connect_bd_net [get_bd_pins DDR_06_AXI_Engine/end_wr] [get_bd_ports DDR_06_end_write]
connect_bd_net [get_bd_pins DDR_06_AXI_Engine/read_data] [get_bd_ports DDR_06_read_data]
connect_bd_net [get_bd_pins DDR_06_AXI_Engine/read_ready] [get_bd_ports DDR_06_read_ready]
connect_bd_net [get_bd_pins DDR_06_AXI_Engine/write_last] [get_bd_ports DDR_06_write_last]
connect_bd_net [get_bd_pins DDR_06_AXI_Engine/write_resp] [get_bd_ports DDR_06_write_resp]
connect_bd_net [get_bd_ports DDR_06_rburst] [get_bd_pins DDR_06_AXI_Engine/rburst]
connect_bd_net [get_bd_ports DDR_06_read_addr] [get_bd_pins DDR_06_AXI_Engine/read_addr]
connect_bd_net [get_bd_ports DDR_06_start_read] [get_bd_pins DDR_06_AXI_Engine/start_rd]
connect_bd_net [get_bd_ports DDR_06_start_write] [get_bd_pins DDR_06_AXI_Engine/start_wr]
connect_bd_net [get_bd_ports DDR_06_wburst] [get_bd_pins DDR_06_AXI_Engine/wburst]
connect_bd_net [get_bd_ports DDR_06_write_addr] [get_bd_pins DDR_06_AXI_Engine/write_addr]
connect_bd_net [get_bd_ports DDR_06_write_data] [get_bd_pins DDR_06_AXI_Engine/write_data]
connect_bd_net [get_bd_ports DDR_06_write_ready] [get_bd_pins DDR_06_AXI_Engine/write_ready]
connect_bd_net [get_bd_pins DDR_07_AXI_Engine/end_rd] [get_bd_ports DDR_07_end_read]
connect_bd_net [get_bd_pins DDR_07_AXI_Engine/end_wr] [get_bd_ports DDR_07_end_write]
connect_bd_net [get_bd_pins DDR_07_AXI_Engine/read_data] [get_bd_ports DDR_07_read_data]
connect_bd_net [get_bd_pins DDR_07_AXI_Engine/read_ready] [get_bd_ports DDR_07_read_ready]
connect_bd_net [get_bd_pins DDR_07_AXI_Engine/write_last] [get_bd_ports DDR_07_write_last]
connect_bd_net [get_bd_pins DDR_07_AXI_Engine/write_resp] [get_bd_ports DDR_07_write_resp]
connect_bd_net [get_bd_ports DDR_07_rburst] [get_bd_pins DDR_07_AXI_Engine/rburst]
connect_bd_net [get_bd_ports DDR_07_read_addr] [get_bd_pins DDR_07_AXI_Engine/read_addr]
connect_bd_net [get_bd_ports DDR_07_start_read] [get_bd_pins DDR_07_AXI_Engine/start_rd]
connect_bd_net [get_bd_ports DDR_07_start_write] [get_bd_pins DDR_07_AXI_Engine/start_wr]
connect_bd_net [get_bd_ports DDR_07_wburst] [get_bd_pins DDR_07_AXI_Engine/wburst]
connect_bd_net [get_bd_ports DDR_07_write_addr] [get_bd_pins DDR_07_AXI_Engine/write_addr]
connect_bd_net [get_bd_ports DDR_07_write_data] [get_bd_pins DDR_07_AXI_Engine/write_data]
connect_bd_net [get_bd_ports DDR_07_write_ready] [get_bd_pins DDR_07_AXI_Engine/write_ready]
connect_bd_net [get_bd_pins DDR_08_AXI_Engine/end_rd] [get_bd_ports DDR_08_end_read]
connect_bd_net [get_bd_pins DDR_08_AXI_Engine/end_wr] [get_bd_ports DDR_08_end_write]
connect_bd_net [get_bd_pins DDR_08_AXI_Engine/read_data] [get_bd_ports DDR_08_read_data]
connect_bd_net [get_bd_pins DDR_08_AXI_Engine/read_ready] [get_bd_ports DDR_08_read_ready]
connect_bd_net [get_bd_pins DDR_08_AXI_Engine/write_last] [get_bd_ports DDR_08_write_last]
connect_bd_net [get_bd_pins DDR_08_AXI_Engine/write_resp] [get_bd_ports DDR_08_write_resp]
connect_bd_net [get_bd_ports DDR_08_rburst] [get_bd_pins DDR_08_AXI_Engine/rburst]
connect_bd_net [get_bd_ports DDR_08_read_addr] [get_bd_pins DDR_08_AXI_Engine/read_addr]
connect_bd_net [get_bd_ports DDR_08_start_read] [get_bd_pins DDR_08_AXI_Engine/start_rd]
connect_bd_net [get_bd_ports DDR_08_start_write] [get_bd_pins DDR_08_AXI_Engine/start_wr]
connect_bd_net [get_bd_ports DDR_08_wburst] [get_bd_pins DDR_08_AXI_Engine/wburst]
connect_bd_net [get_bd_ports DDR_08_write_addr] [get_bd_pins DDR_08_AXI_Engine/write_addr]
connect_bd_net [get_bd_ports DDR_08_write_data] [get_bd_pins DDR_08_AXI_Engine/write_data]
connect_bd_net [get_bd_ports DDR_08_write_ready] [get_bd_pins DDR_08_AXI_Engine/write_ready]
connect_bd_net [get_bd_pins DDR_09_AXI_Engine/end_rd] [get_bd_ports DDR_09_end_read]
connect_bd_net [get_bd_pins DDR_09_AXI_Engine/end_wr] [get_bd_ports DDR_09_end_write]
connect_bd_net [get_bd_pins DDR_09_AXI_Engine/read_data] [get_bd_ports DDR_09_read_data]
connect_bd_net [get_bd_pins DDR_09_AXI_Engine/read_ready] [get_bd_ports DDR_09_read_ready]
connect_bd_net [get_bd_pins DDR_09_AXI_Engine/write_last] [get_bd_ports DDR_09_write_last]
connect_bd_net [get_bd_pins DDR_09_AXI_Engine/write_resp] [get_bd_ports DDR_09_write_resp]
connect_bd_net [get_bd_ports DDR_09_rburst] [get_bd_pins DDR_09_AXI_Engine/rburst]
connect_bd_net [get_bd_ports DDR_09_read_addr] [get_bd_pins DDR_09_AXI_Engine/read_addr]
connect_bd_net [get_bd_ports DDR_09_start_read] [get_bd_pins DDR_09_AXI_Engine/start_rd]
connect_bd_net [get_bd_ports DDR_09_start_write] [get_bd_pins DDR_09_AXI_Engine/start_wr]
connect_bd_net [get_bd_ports DDR_09_wburst] [get_bd_pins DDR_09_AXI_Engine/wburst]
connect_bd_net [get_bd_ports DDR_09_write_addr] [get_bd_pins DDR_09_AXI_Engine/write_addr]
connect_bd_net [get_bd_ports DDR_09_write_data] [get_bd_pins DDR_09_AXI_Engine/write_data]
connect_bd_net [get_bd_ports DDR_09_write_ready] [get_bd_pins DDR_09_AXI_Engine/write_ready]
connect_bd_net [get_bd_pins DDR_10_AXI_Engine/end_rd] [get_bd_ports DDR_10_end_read]
connect_bd_net [get_bd_pins DDR_10_AXI_Engine/end_wr] [get_bd_ports DDR_10_end_write]
connect_bd_net [get_bd_pins DDR_10_AXI_Engine/read_data] [get_bd_ports DDR_10_read_data]
connect_bd_net [get_bd_pins DDR_10_AXI_Engine/read_ready] [get_bd_ports DDR_10_read_ready]
connect_bd_net [get_bd_pins DDR_10_AXI_Engine/write_last] [get_bd_ports DDR_10_write_last]
connect_bd_net [get_bd_pins DDR_10_AXI_Engine/write_resp] [get_bd_ports DDR_10_write_resp]
connect_bd_net [get_bd_ports DDR_10_rburst] [get_bd_pins DDR_10_AXI_Engine/rburst]
connect_bd_net [get_bd_ports DDR_10_read_addr] [get_bd_pins DDR_10_AXI_Engine/read_addr]
connect_bd_net [get_bd_ports DDR_10_start_read] [get_bd_pins DDR_10_AXI_Engine/start_rd]
connect_bd_net [get_bd_ports DDR_10_start_write] [get_bd_pins DDR_10_AXI_Engine/start_wr]
connect_bd_net [get_bd_ports DDR_10_wburst] [get_bd_pins DDR_10_AXI_Engine/wburst]
connect_bd_net [get_bd_ports DDR_10_write_addr] [get_bd_pins DDR_10_AXI_Engine/write_addr]
connect_bd_net [get_bd_ports DDR_10_write_data] [get_bd_pins DDR_10_AXI_Engine/write_data]
connect_bd_net [get_bd_ports DDR_10_write_ready] [get_bd_pins DDR_10_AXI_Engine/write_ready]
connect_bd_net [get_bd_pins DDR_11_AXI_Engine/end_rd] [get_bd_ports DDR_11_end_read]
connect_bd_net [get_bd_pins DDR_11_AXI_Engine/end_wr] [get_bd_ports DDR_11_end_write]
connect_bd_net [get_bd_pins DDR_11_AXI_Engine/read_data] [get_bd_ports DDR_11_read_data]
connect_bd_net [get_bd_pins DDR_11_AXI_Engine/read_ready] [get_bd_ports DDR_11_read_ready]
connect_bd_net [get_bd_pins DDR_11_AXI_Engine/write_last] [get_bd_ports DDR_11_write_last]
connect_bd_net [get_bd_pins DDR_11_AXI_Engine/write_resp] [get_bd_ports DDR_11_write_resp]
connect_bd_net [get_bd_ports DDR_11_rburst] [get_bd_pins DDR_11_AXI_Engine/rburst]
connect_bd_net [get_bd_ports DDR_11_read_addr] [get_bd_pins DDR_11_AXI_Engine/read_addr]
connect_bd_net [get_bd_ports DDR_11_start_read] [get_bd_pins DDR_11_AXI_Engine/start_rd]
connect_bd_net [get_bd_ports DDR_11_start_write] [get_bd_pins DDR_11_AXI_Engine/start_wr]
connect_bd_net [get_bd_ports DDR_11_wburst] [get_bd_pins DDR_11_AXI_Engine/wburst]
connect_bd_net [get_bd_ports DDR_11_write_addr] [get_bd_pins DDR_11_AXI_Engine/write_addr]
connect_bd_net [get_bd_ports DDR_11_write_data] [get_bd_pins DDR_11_AXI_Engine/write_data]
connect_bd_net [get_bd_ports DDR_11_write_ready] [get_bd_pins DDR_11_AXI_Engine/write_ready]
connect_bd_net [get_bd_pins DDR_12_AXI_Engine/end_rd] [get_bd_ports DDR_12_end_read]
connect_bd_net [get_bd_pins DDR_12_AXI_Engine/end_wr] [get_bd_ports DDR_12_end_write]
connect_bd_net [get_bd_pins DDR_12_AXI_Engine/read_data] [get_bd_ports DDR_12_read_data]
connect_bd_net [get_bd_pins DDR_12_AXI_Engine/read_ready] [get_bd_ports DDR_12_read_ready]
connect_bd_net [get_bd_pins DDR_12_AXI_Engine/write_last] [get_bd_ports DDR_12_write_last]
connect_bd_net [get_bd_pins DDR_12_AXI_Engine/write_resp] [get_bd_ports DDR_12_write_resp]
connect_bd_net [get_bd_ports DDR_12_rburst] [get_bd_pins DDR_12_AXI_Engine/rburst]
connect_bd_net [get_bd_ports DDR_12_read_addr] [get_bd_pins DDR_12_AXI_Engine/read_addr]
connect_bd_net [get_bd_ports DDR_12_start_read] [get_bd_pins DDR_12_AXI_Engine/start_rd]
connect_bd_net [get_bd_ports DDR_12_start_write] [get_bd_pins DDR_12_AXI_Engine/start_wr]
connect_bd_net [get_bd_ports DDR_12_wburst] [get_bd_pins DDR_12_AXI_Engine/wburst]
connect_bd_net [get_bd_ports DDR_12_write_addr] [get_bd_pins DDR_12_AXI_Engine/write_addr]
connect_bd_net [get_bd_ports DDR_12_write_data] [get_bd_pins DDR_12_AXI_Engine/write_data]
connect_bd_net [get_bd_ports DDR_12_write_ready] [get_bd_pins DDR_12_AXI_Engine/write_ready]
connect_bd_net [get_bd_pins DDR_13_AXI_Engine/end_rd] [get_bd_ports DDR_13_end_read]
connect_bd_net [get_bd_pins DDR_13_AXI_Engine/end_wr] [get_bd_ports DDR_13_end_write]
connect_bd_net [get_bd_pins DDR_13_AXI_Engine/read_data] [get_bd_ports DDR_13_read_data]
connect_bd_net [get_bd_pins DDR_13_AXI_Engine/read_ready] [get_bd_ports DDR_13_read_ready]
connect_bd_net [get_bd_pins DDR_13_AXI_Engine/write_last] [get_bd_ports DDR_13_write_last]
connect_bd_net [get_bd_pins DDR_13_AXI_Engine/write_resp] [get_bd_ports DDR_13_write_resp]
connect_bd_net [get_bd_ports DDR_13_rburst] [get_bd_pins DDR_13_AXI_Engine/rburst]
